# EasyEDA Pro project EasyEDA Pro full project export 0.07.epro, schematic schematic1, sheets 7 to 13 of 13

## Sheets
7 Processor: Page Name: Processor; Update Date: 2024-11-29; Drawn: EasyEDA; Page Size: A4
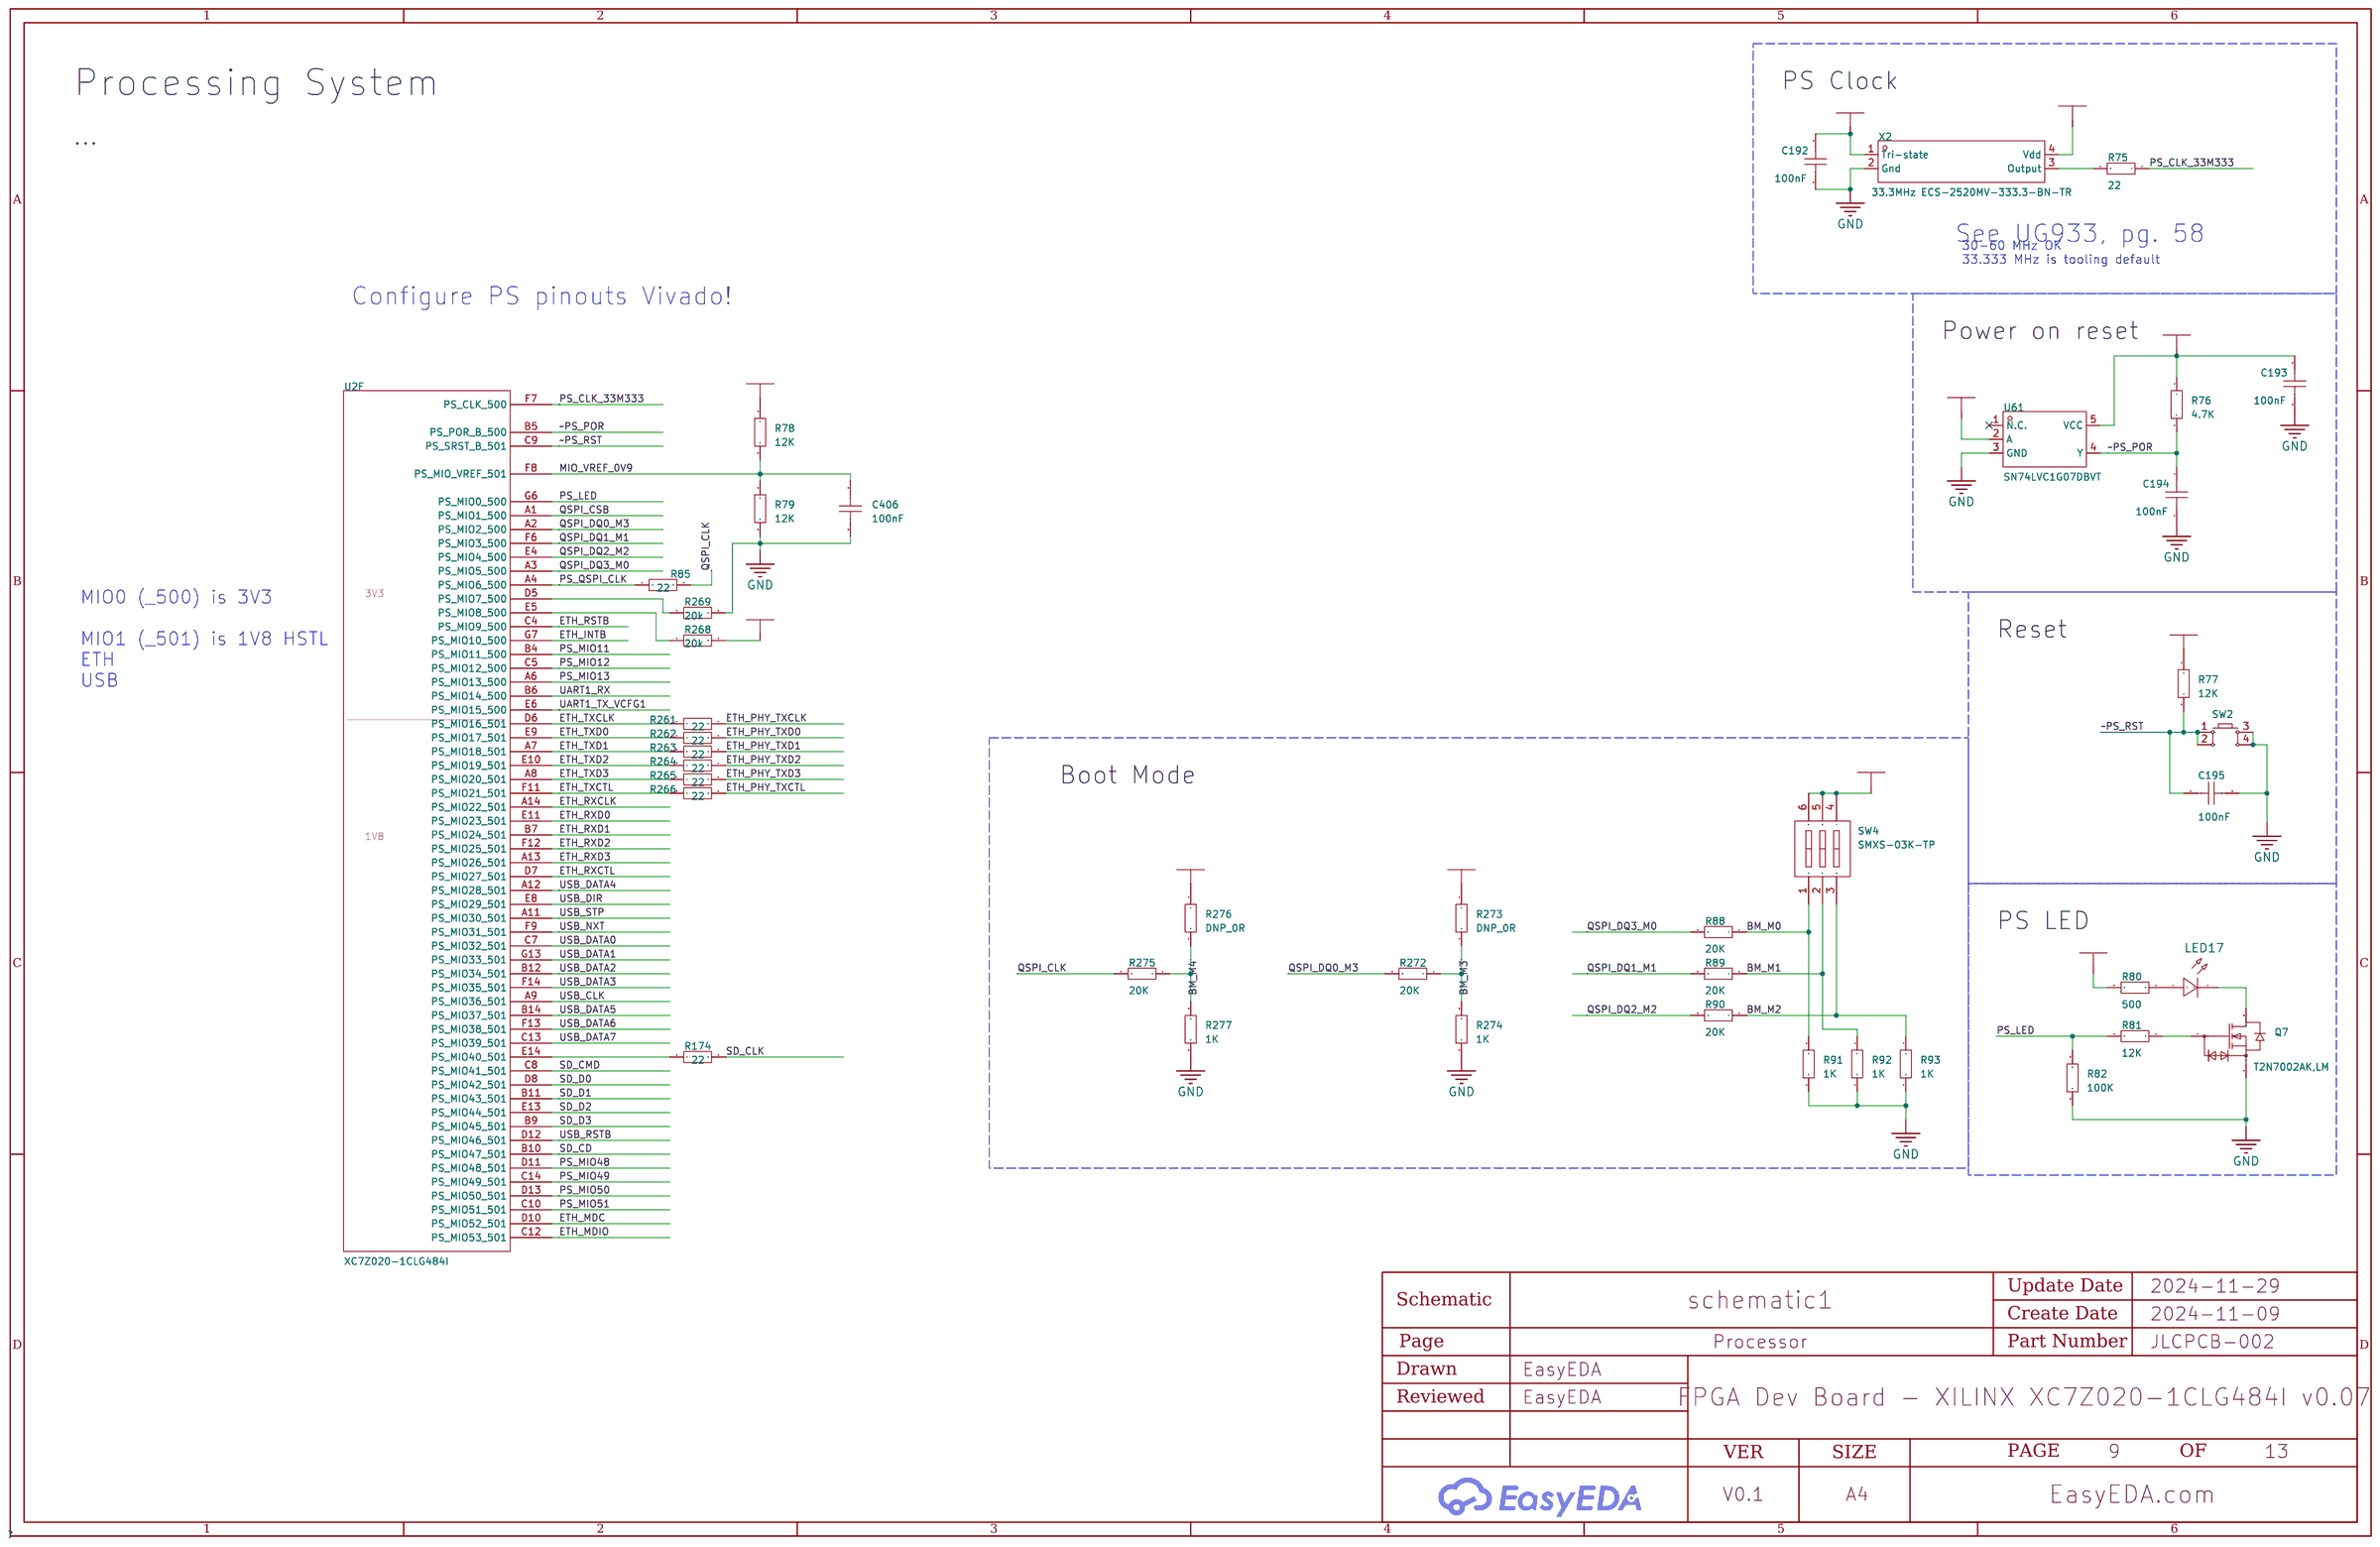
[diagram p6: Processor]
8 Program: Create Date: 2024-06-13; Page Name: Program; Project Name: FPGA Dev Board - XILINX XC7Z020-1CLG484I v0.06; Update Date: 2024-06-13; Drawn: EasyEDA; Page Size: A4
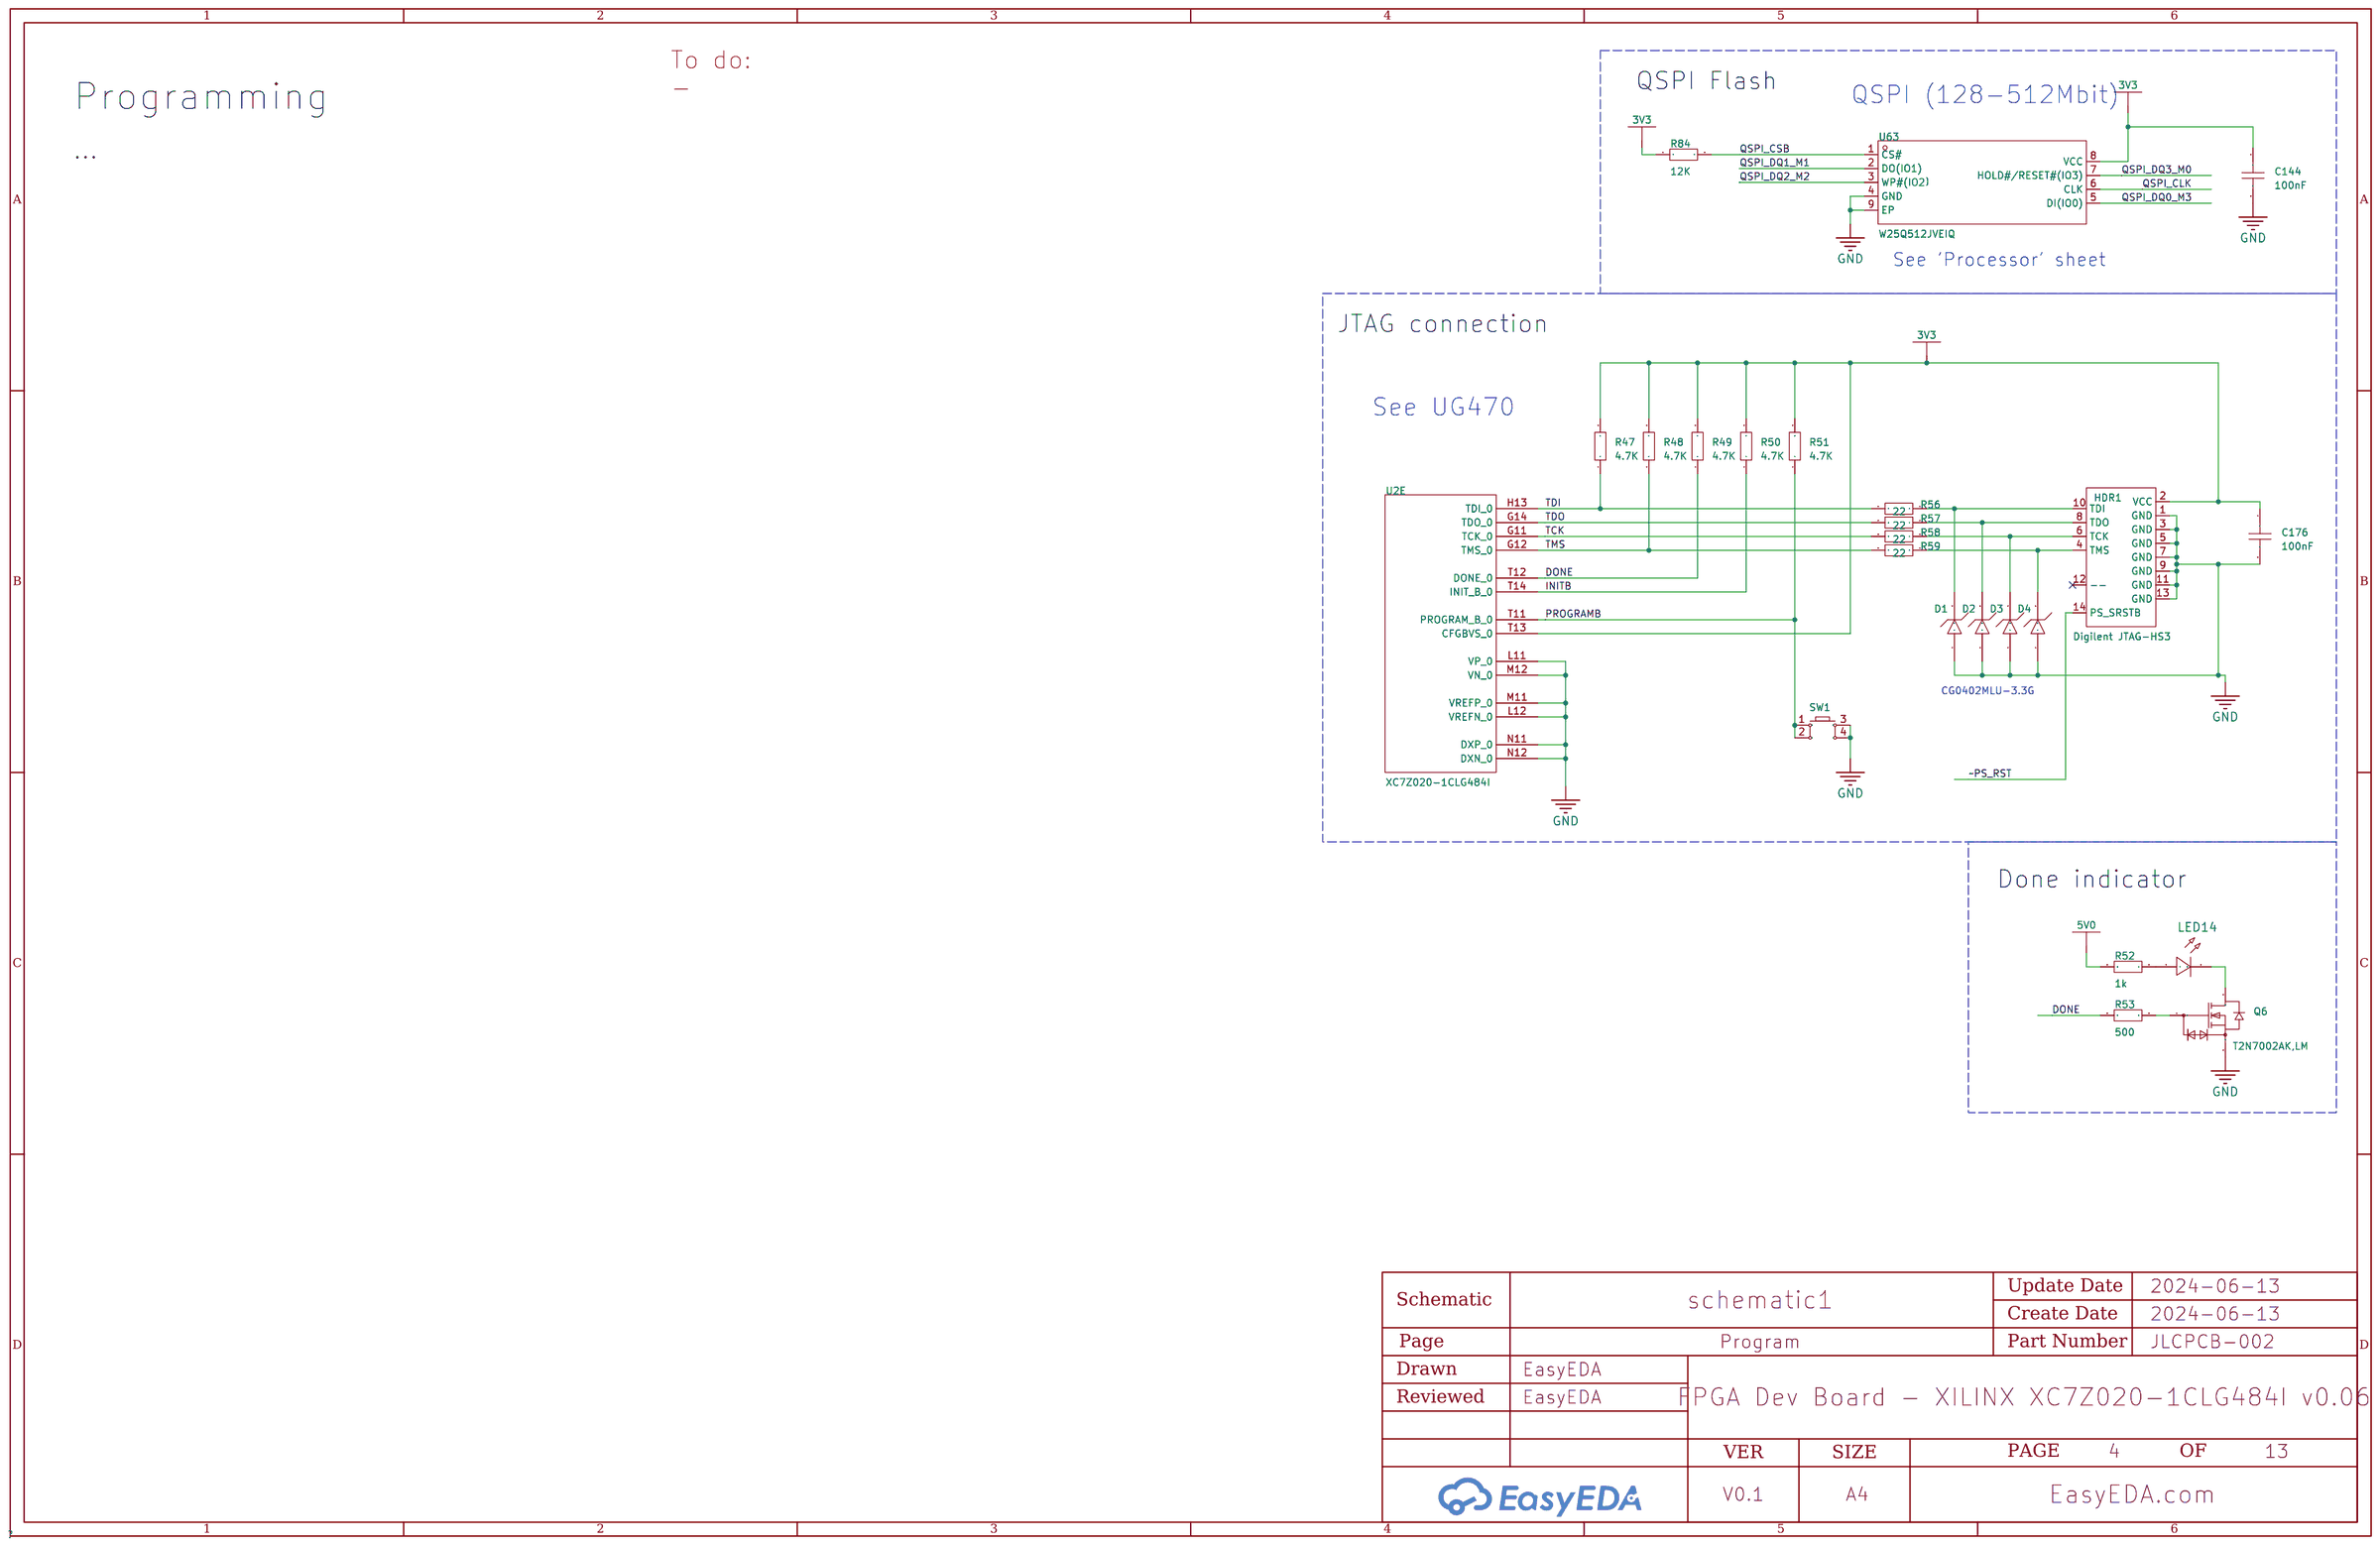
[diagram p7: Program]
9 HDMI: Create Date: 2024-04-13; Page Name: HDMI; Project Name: FPGA Dev Board - XILINX XC7Z020-1CLG484I; Schematic Name: Schematic1; Update Date: 2024-04-29; Drawn: EasyEDA; Page Size: A4
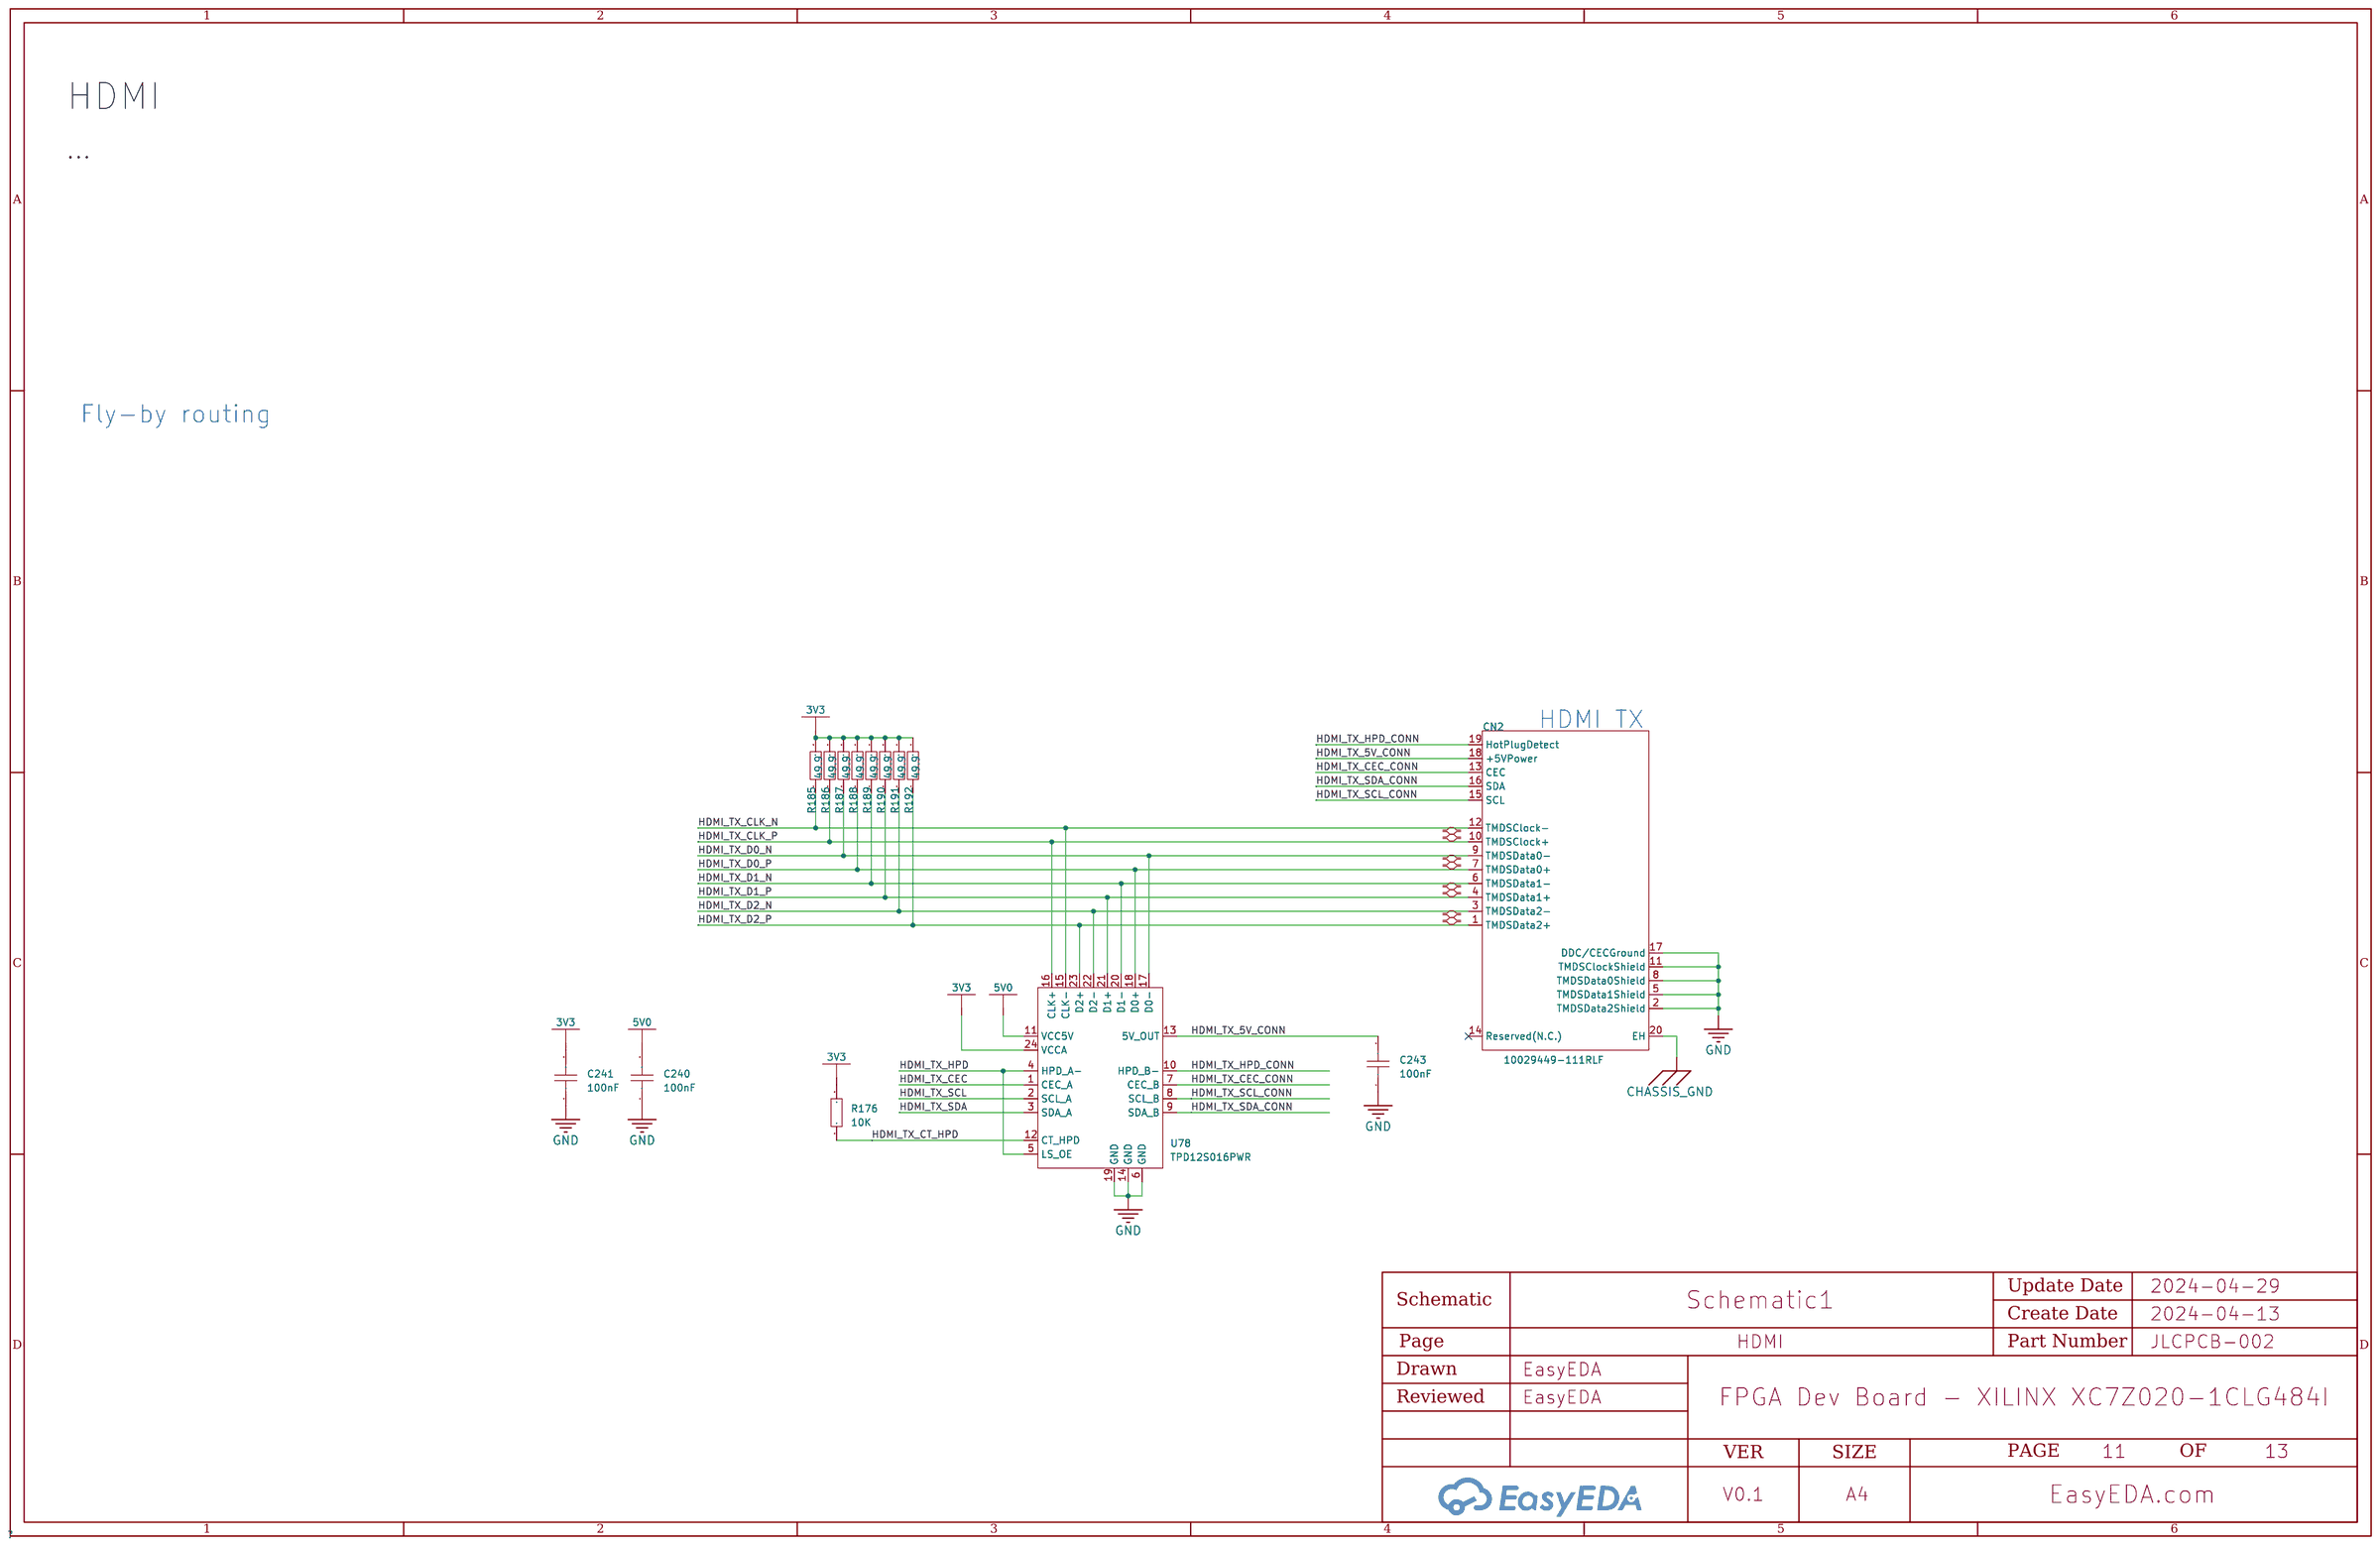
[diagram p8: HDMI]
10 Banks 34,35 - HDMI, Expansion: Page Name: Banks 34,35 - HDMI, Expansion; Update Date: 2024-11-09; Drawn: EasyEDA; Page Size: A4
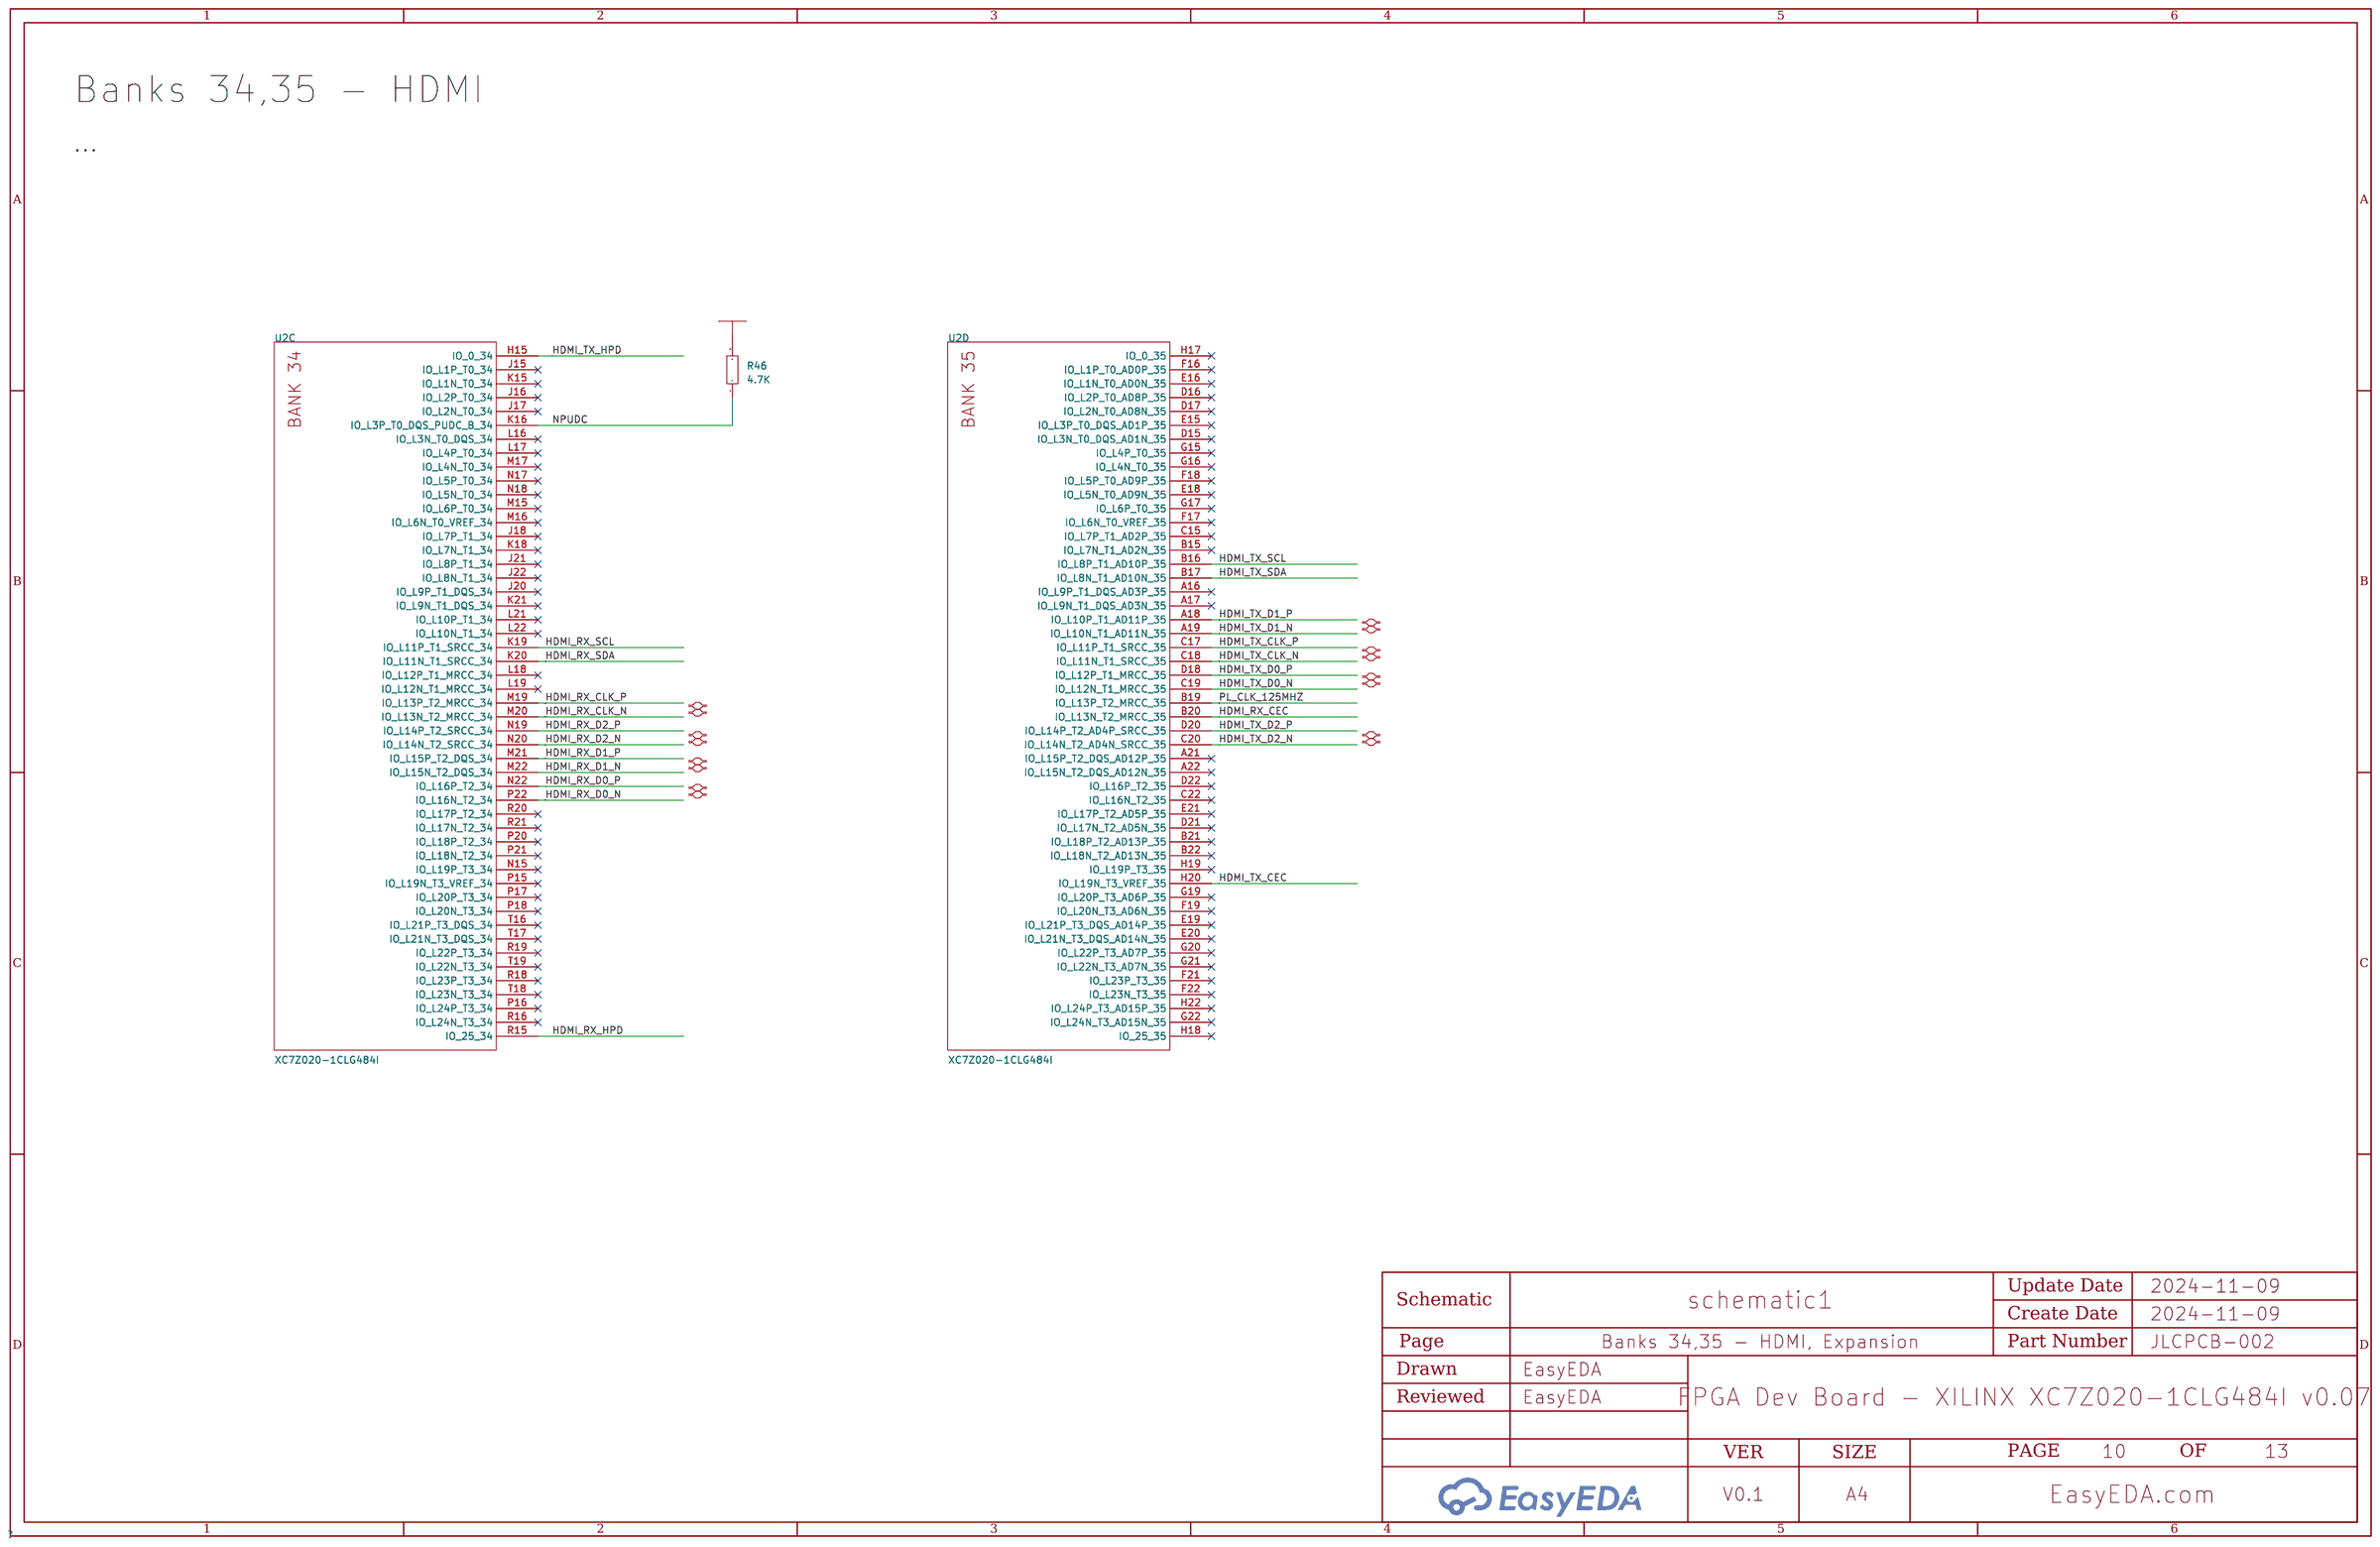
[diagram p9: Banks 34,35 - HDMI, Expansion]
11 Banks 13,33 - Expansion: Create Date: 2024-05-18; Page Name: Banks 13,33 - Expansion; Project Name: FPGA Dev Board - XILINX XC7Z020-1CLG484I v0.02; Update Date: 2024-05-18; Drawn: EasyEDA; Page Size: A4
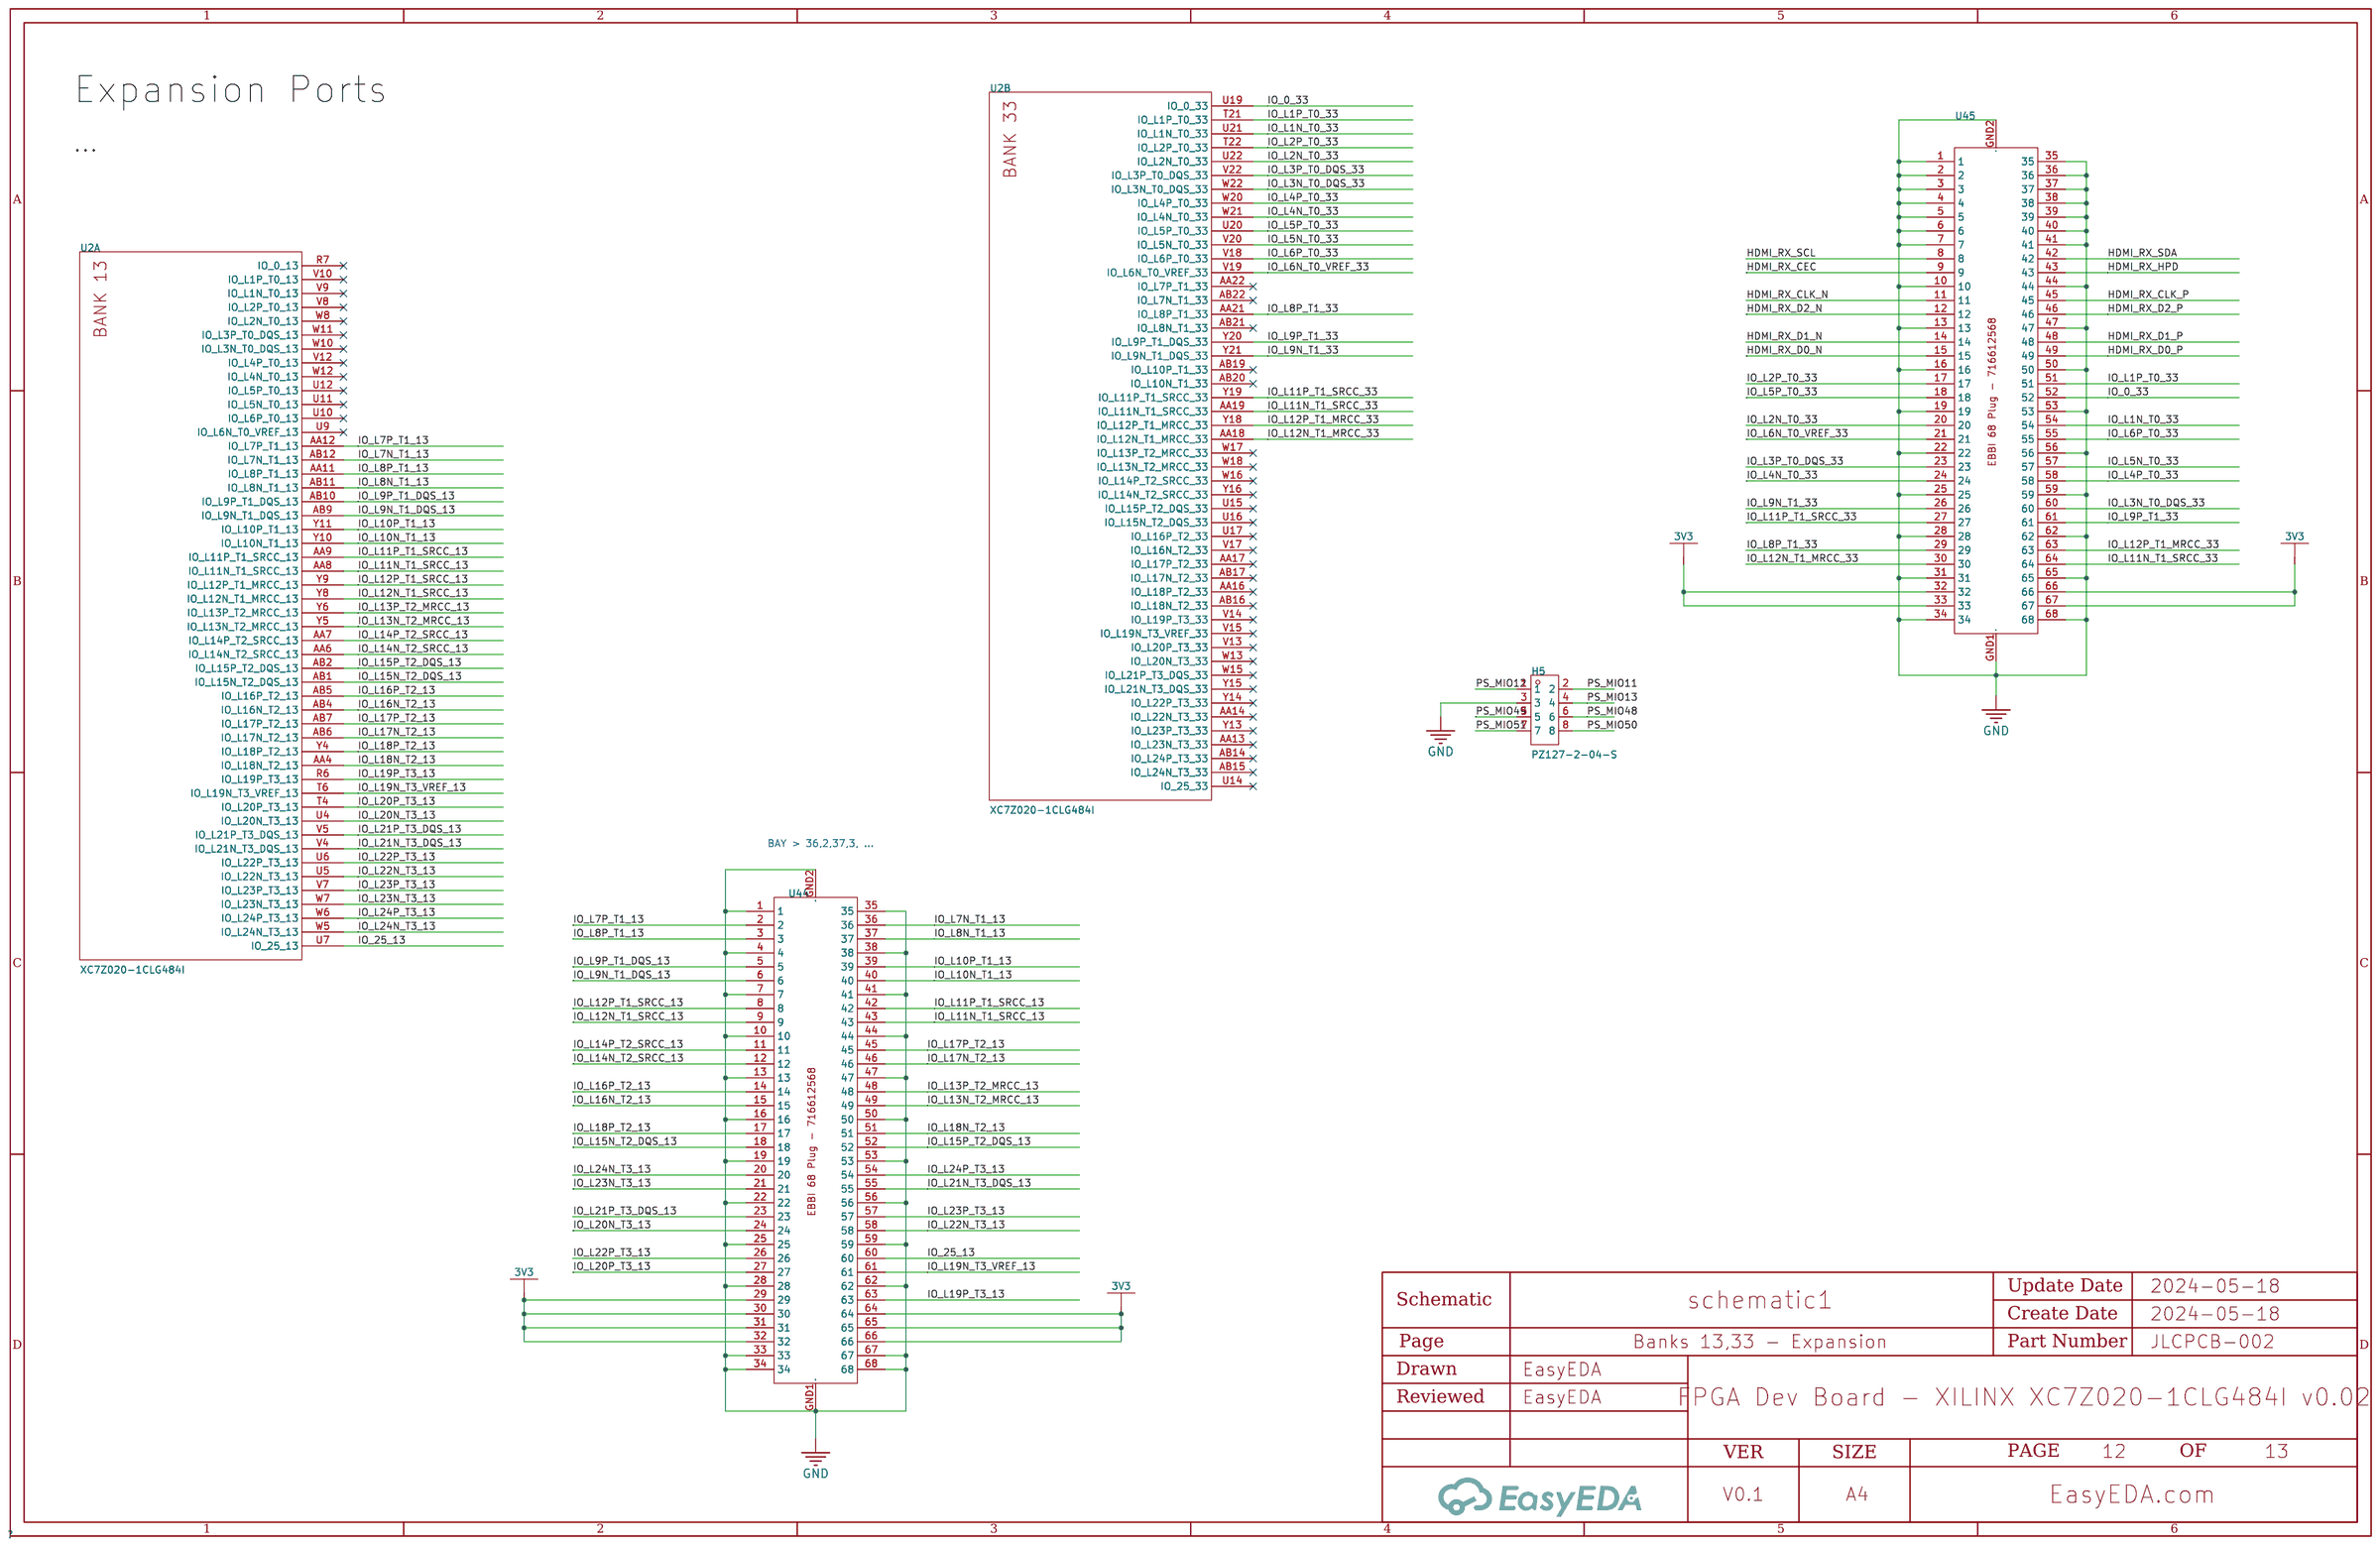
[diagram p10: Banks 13,33 - Expansion]
12 SD Card: Create Date: 2024-04-20; Page Name: SD Card; Project Name: FPGA Dev Board - XILINX XC7Z020-1CLG484I; Schematic Name: Schematic1; Update Date: 2024-04-29; Drawn: EasyEDA; Page Size: A4
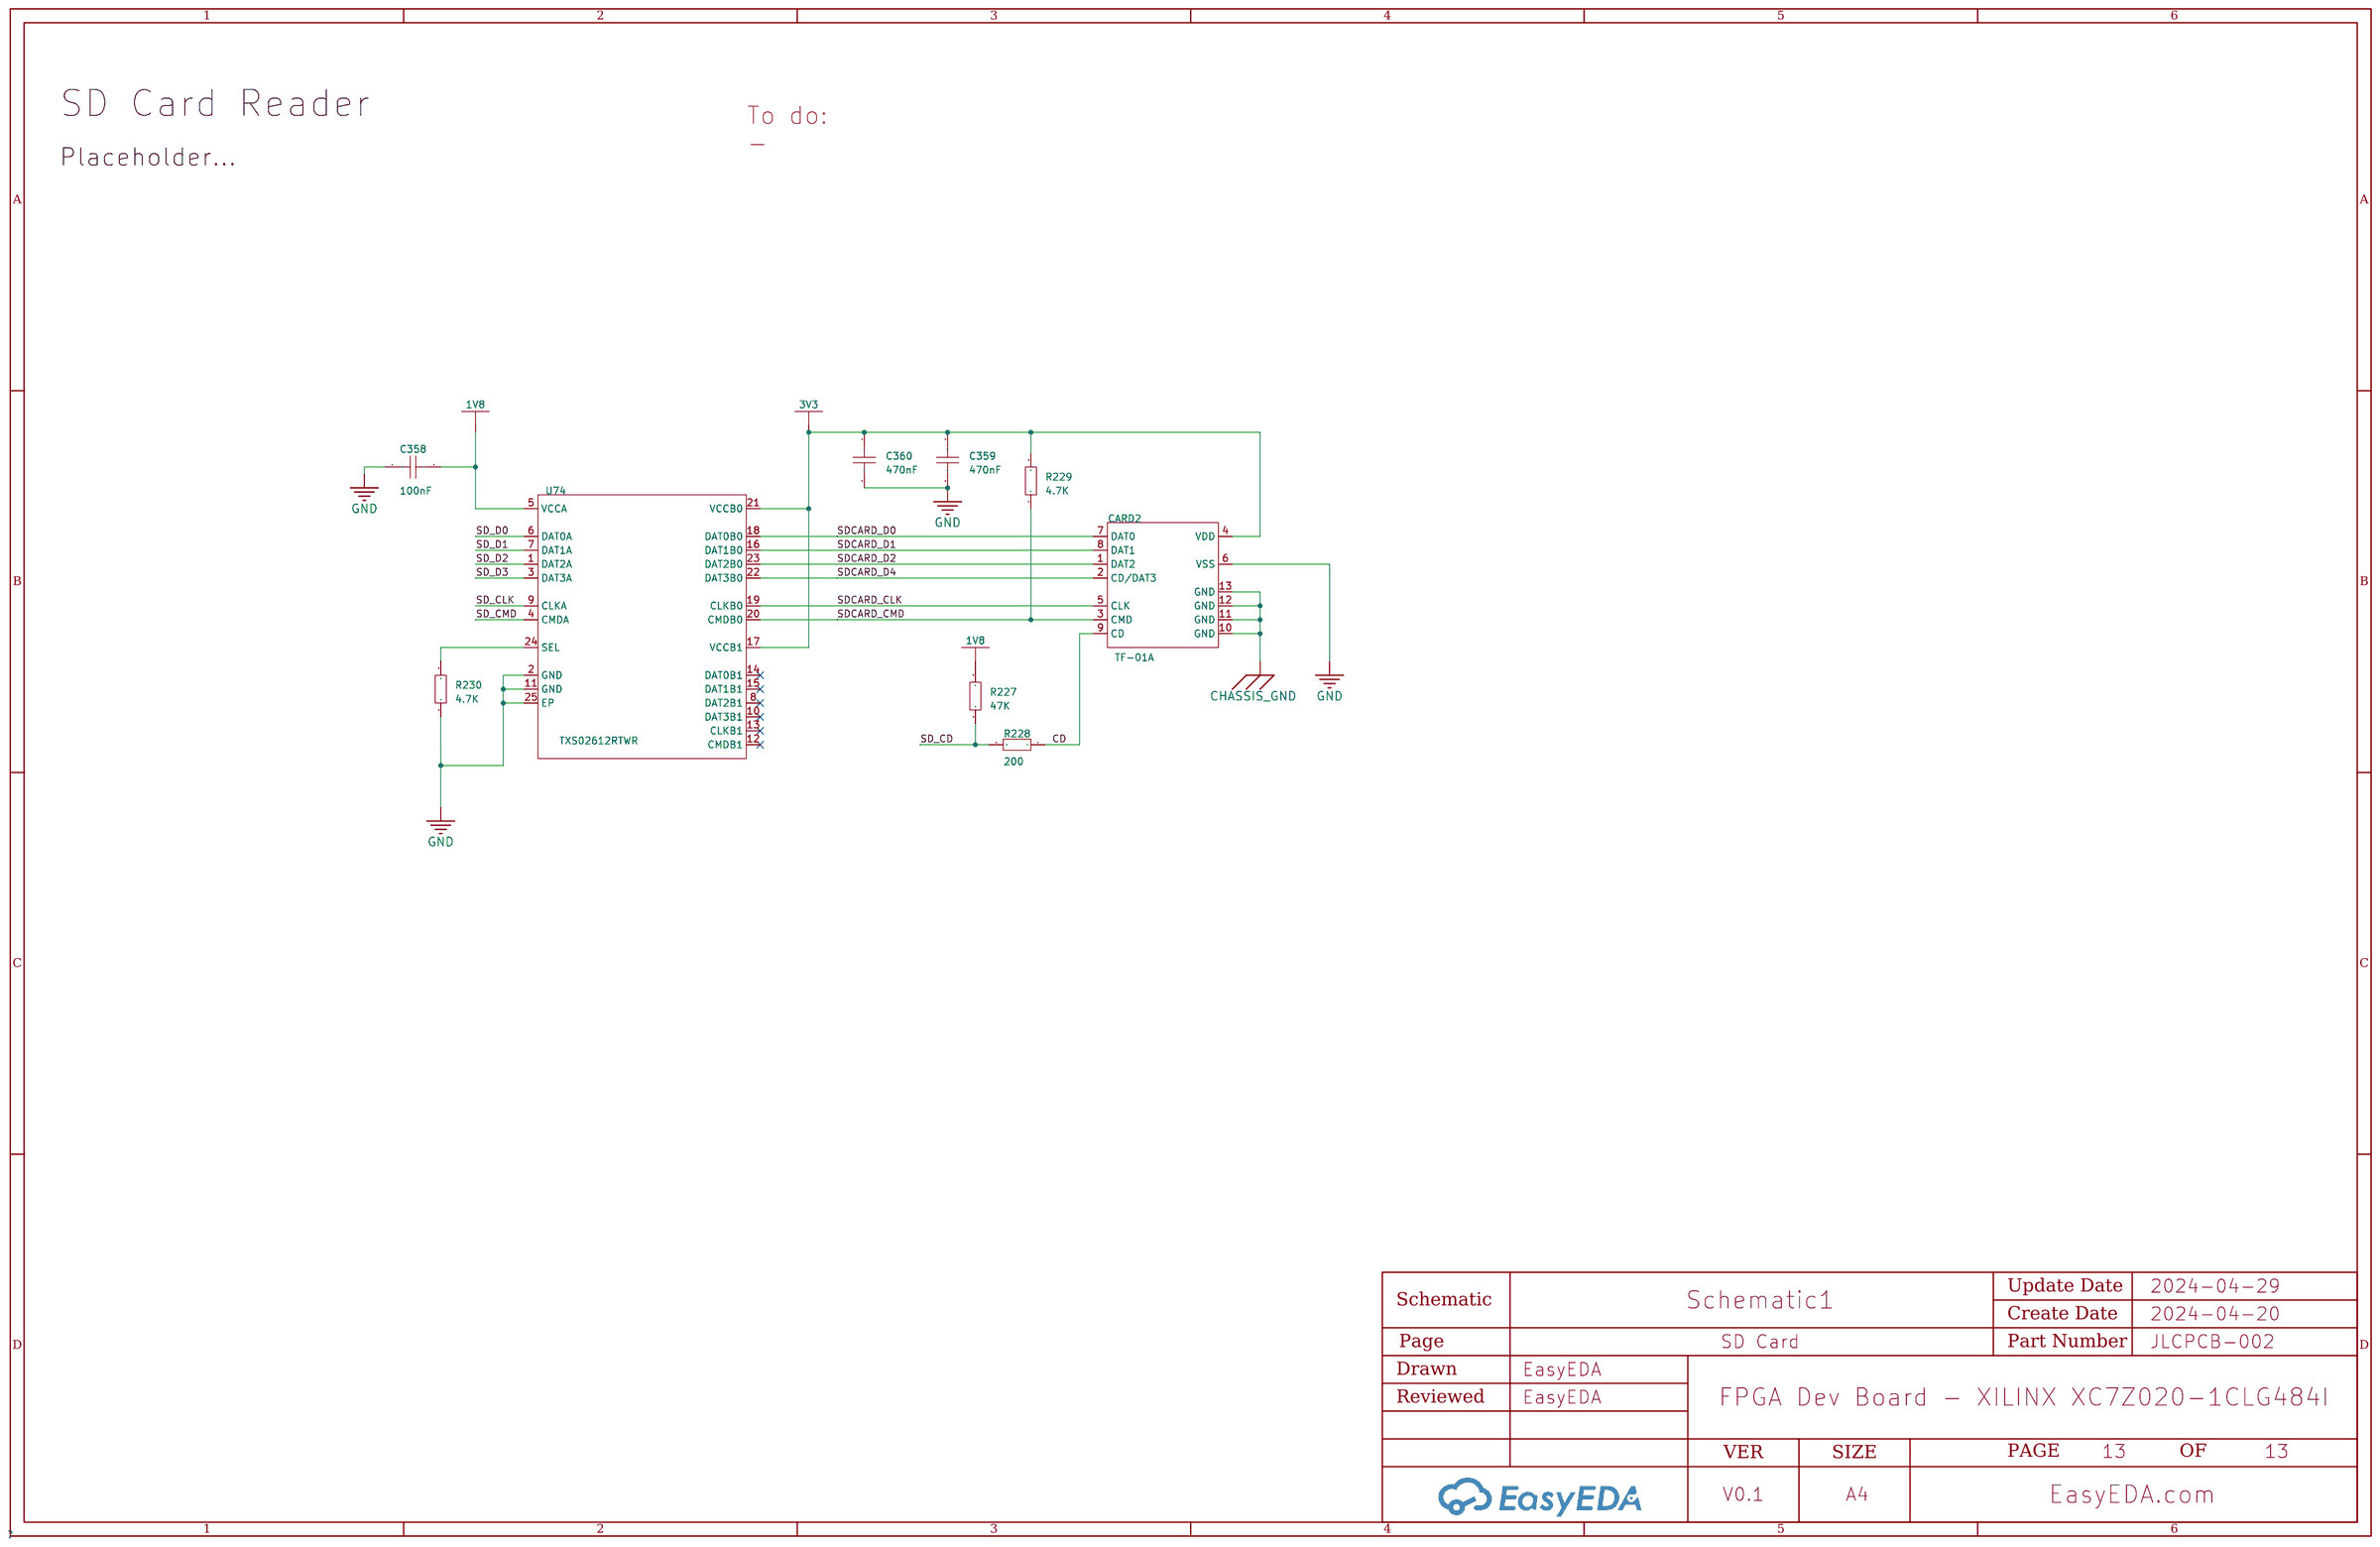
[diagram p11: SD Card]
13 USB USB3320: Create Date: 2024-04-21; Page Name: USB USB3320; Project Name: FPGA Dev Board - XILINX XC7Z020-1CLG484I; Schematic Name: Schematic1; Update Date: 2024-04-29; Drawn: EasyEDA; Page Size: A4
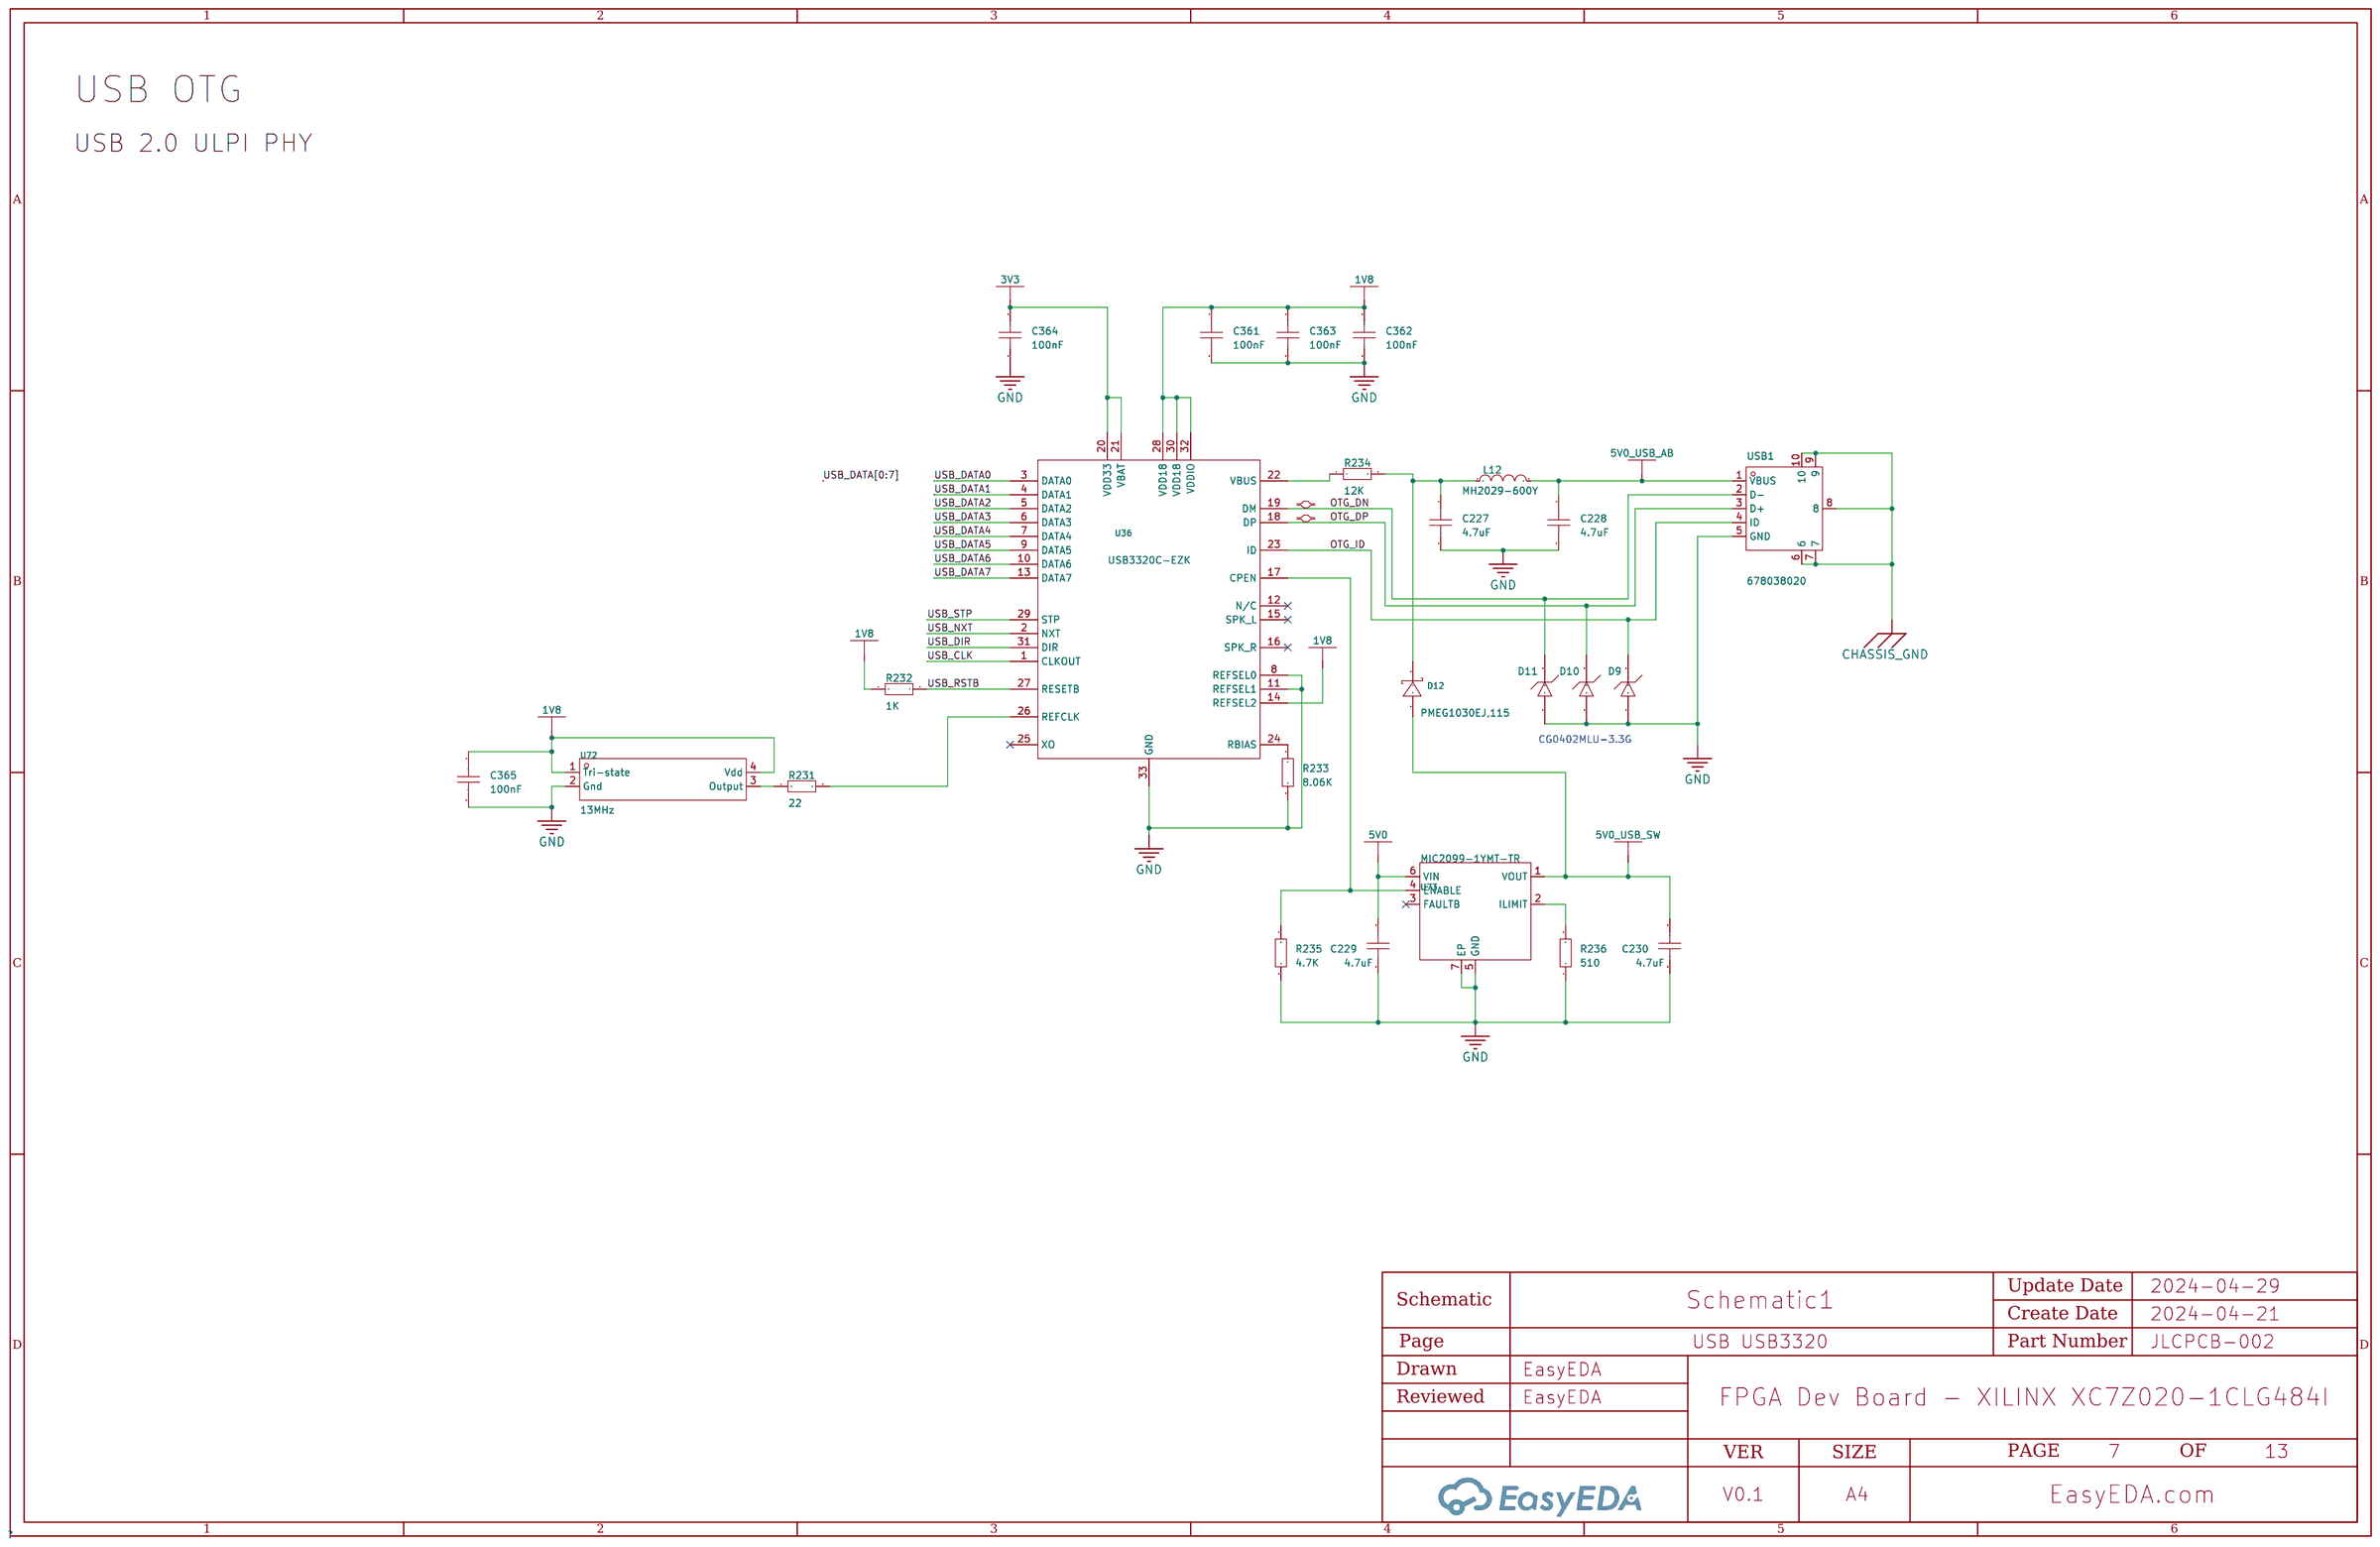
[diagram p12: USB USB3320]

## Parts
sheet Banks 13,33 - Expansion
H5  PZ127-2-04-S  [HDR-SMD_8P-P1.27-V-M-C2-C4-LS5.3]
U44  -  [EBBI 68 Plug - 716612568]
U45  -  [EBBI 68 Plug - 716612568]
sheet Banks 34,35 - HDMI, Expansion
R46  4.7K  [R0603]
sheet HDMI
C240  100nF  [C0603]
C241  100nF  [C0603]
C243  100nF  [C0603]
CN2  10029449-111RLF  [HDMI-SMD_10029449-001RLF]
R176  10K  [R0603]
R185  49.9  [R0402]
R186  49.9  [R0402]
R187  49.9  [R0402]
R188  49.9  [R0402]
R189  49.9  [R0402]
R190  49.9  [R0402]
R191  49.9  [R0402]
R192  49.9  [R0402]
U78  TPD12S016PWR  [TSSOP-24_L7.8-W4.4-P0.65-LS6.4-BL]
sheet Power
U2  XC7Z020-1CLG484I  [FBGA-484_L19.0-W19.0-R22-C22-P0.80-TL]  (sections 1,10,2,3,4,5,6,7,8,9)
sheet Processor
C192  100nF  [C0603]
C193  100nF  [C0603]
C194  100nF  [C0603]
C195  100nF  [C0603]
C406  100nF  [C0201]
LED17  -  [LED0603-R-RD]
Q7  T2N7002AK,LM  [SOT-23-3_L2.9-W1.3-P1.90-LS2.4-BR]
R75  22  [R0603]
R76  4.7K  [R0603]
R77  12K  [R0603]
R78  12K  [R0603]
R79  12K  [R0603]
R80  500  [R0603]
R81  12K  [R0603]
R82  100K  [R0603]
R85  22  [R0603]
R88  20K  [R0603]
R89  20K  [R0603]
R90  20K  [R0603]
R91  1K  [R0603]
R92  1K  [R0603]
R93  1K  [R0603]
R174  22  [R0603]
R261  22  [R0402]
R262  22  [R0402]
R263  22  [R0402]
R264  22  [R0402]
R265  22  [R0402]
R266  22  [R0402]
R268  20k  [R0402]
R269  20k  [R0402]
R272  20K  [R0603]
R273  DNP_0R  [R0603]
R274  1K  [R0603]
R275  20K  [R0603]
R276  DNP_0R  [R0603]
R277  1K  [R0603]
SW2  -  [SW-SMD_4P-L6.0-W6.0-P4.50-LS9.0-2]
SW4  SMXS-03K-TP  [SW-SMD_SMXS-03K-TP]
U61  SN74LVC1G07DBVT  [SOT-23-5_L2.9-W1.6-P0.95-LS2.8-BR]
X2  33.3MHz ECS-2520MV-333.3-BN-TR  [OSC-SMD_4P-L2.5-W2.0-BL]
sheet Program
C144  100nF  [C0603]
C176  100nF  [C0603]
D1  -  [D0402]
D2  -  [D0402]
D3  -  [D0402]
D4  -  [D0402]
HDR1  Digilent JTAG-HS3  [HDR-SMD_14P-P2.54-V-M-R2-C7-LS7.4]
LED14  -  [LED0603-R-RD]
Q6  T2N7002AK,LM  [SOT-23-3_L2.9-W1.3-P1.90-LS2.4-BR]
R47  4.7K  [R0603]
R48  4.7K  [R0603]
R49  4.7K  [R0603]
R50  4.7K  [R0603]
R51  4.7K  [R0603]
R52  1k  [R0603]
R53  500  [R0603]
R56  22  [R0603]
R57  22  [R0603]
R58  22  [R0603]
R59  22  [R0603]
R84  12K  [R0603]
SW1  -  [SW-SMD_4P-L6.0-W6.0-P4.50-LS9.0-2]
U63  W25Q512JVEIQ  [WSON-8_L8.0-W6.0-P1.27-TL-EP]
sheet SD Card
C358  100nF  [C0402]
C359  470nF  [C0402]
C360  470nF  [C0402]
CARD2  TF-01A  [TF-SMD_TF-02]
R227  47K  [R0402]
R228  200  [R0402]
R229  4.7K  [R0402]
R230  4.7K  [R0402]
U74  TXS02612RTWR  [WQFN-24_L4.0-W4.0-P0.50-TL-EP2.5]
sheet USB USB3320
C227  4.7uF  [C0603]
C228  4.7uF  [C0603]
C229  4.7uF  [C0603]
C230  4.7uF  [C0603]
C361  100nF  [C0402]
C362  100nF  [C0402]
C363  100nF  [C0402]
C364  100nF  [C0402]
C365  100nF  [C0402]
D9  -  [D0402]
D10  -  [D0402]
D11  -  [D0402]
D12  PMEG1030EJ,115  [SOD-323_L1.8-W1.3-LS2.5-RD]
L12  MH2029-600Y  [L0805]
R231  22  [R0402]
R232  1K  [R0402]
R233  8.06K  [R0402]
R234  12K  [R0402]
R235  4.7K  [R0402]
R236  510  [R0402]
U36  USB3320C-EZK  [QFN-32_L5.0-W5.0-P0.50-BL-EP3.4]
U72  13MHz  [OSC-SMD_4P-L2.5-W2.0-BL]
U73  MIC2099-1YMT-TR  [UDFN-6_L1.6-W1.6-P0.50-BL-EP1.2]
USB1  678038020  [MICRO-USB-SMD_MOLEX_678038020]

## Library data of the parts
H5 = PZ127-2-04-S: Pin Structure:2x4P Pitch:1.27mm Row Spacing:1.27mm Circluar Pins/Square Pins:Square Pins Mounting Type:Brick nogging Number of Rows:双排 Number of Pins:8P Current Rating (Max):1A Length of Mating Pin:4mm Insulation Height:1.5mm Length of End Connection Pin:; LCSC Part Name: 2x4P 间距:1.27mm 方针 立贴; Supplier Part: C3975187; Manufacturer: HCTL(华灿天禄); Supplier Footprint: SMD,P=1.27mm; JLCPCB Part Class: Extended Part; Datasheet: https://atta.szlcsc.com/upload/public/pdf/source/20230609/2ACB07ADC7D4DAF6D292F3D23C037F6C.pdf; Supplier: LCSC; Pin Structure: 2x4P; Pitch: 1.27mm; Row Spacing: 1.27mm; Circluar Pins/Square Pins: Square Pins; Mounting Type: Brick nogging; Number of Rows: 双排; Number of Pins: 8P; Current Rating (Max): 1A; Length of Mating Pin: 4mm; Insulation Height: 1.5mm; Operating Temperature Range: -40℃~+105℃; Soldering Temperature(Max): 260℃@10S; Color: Black
U44 U45 = EBBI 68 Plug - 716612568
R46-R53 R56-R59 R75-R82 R84 R85 R88-R93 R174 R176 R272-R277 = Res_0603: Supplier Footprint: 0603
C144 C176 C192-C195 C227-C230 C240 C241 C243 = CAP_0603: Supplier Footprint: 0603
CN2 = 10029449-111RLF: Supplier Part: C427307; Manufacturer: Amphenol; Supplier Footprint: SMD; JLCPCB Part Class: Extended Part; Datasheet: https://atta.szlcsc.com/upload/public/pdf/source/20190916/C428493_2220CBF119BDA60368E33A9DE2491E6D.pdf; Supplier: LCSC
R185-R192 R227-R236 R261-R266 R268 R269 = Res_0402: Supplier Footprint: 0402
U78 = TPD12S016PWR: Supply Voltage:4.5V~5.5V Supply Voltage:4.5V~5.5V; LCSC Part Name: 具有I2C电平转换缓冲器 12通道ESD保护和限流负载开关的HDMI配套芯片; Supplier Part: C201665; Manufacturer: TI(德州仪器); Supplier Footprint: TSSOP-24; JLCPCB Part Class: Extended Part; Datasheet: https://www.ti.com/cn/lit/gpn/tpd12s016; Supplier: LCSC; Supply Voltage: 4.5V~5.5V
U2 = XC7Z020-1CLG484I: LCSC Part Name: XC7Z020-1CLG484I -; Supplier Part: C89055; Manufacturer: XILINX(赛灵思); Supplier Footprint: BGA-484; JLCPCB Part Class: Extended Part; Datasheet: https://atta.szlcsc.com/upload/public/pdf/source/20180115/C157624_15160149665121269420.pdf; Supplier: LCSC
C406 = CAP_0201: Supplier Footprint: 0201
LED14 LED17 = LED_0603-R: Supplier Footprint: 0603
Q6 Q7 = T2N7002AK,LM: Type:1个NChannel Drain Source Voltage (Vdss):60V Continuous Drain Current (Id): Power Dissipation (Pd): Drain Source On Resistance (RDS(on)@Vgs,Id): Gate Threshold Voltage (Vgs(th)@Id):2.1V@250uA Total Gate Charge (Qg@Vgs):350pC@4.5V Input Capacitance (Cis; LCSC Part Name: 1个N沟道 耐压:60V 电流:200mA; Supplier Part: C516175; Manufacturer: TOSHIBA(东芝); Supplier Footprint: SOT-23; JLCPCB Part Class: Extended Part; Datasheet: https://atta.szlcsc.com/upload/public/pdf/source/20200417/C516175_139D8835A6055C9B9867ECE2E4073B8F.pdf; Supplier: LCSC; Type: 1个NChannel; Drain Source Voltage (Vdss): 60V; Gate Threshold Voltage (Vgs(th)@Id): 2.1V@250uA; Total Gate Charge (Qg@Vgs): 350pC@4.5V; Input Capacitance (Ciss@Vds): 17pF@10V
SW1 SW2 = Key_SMD_6x6x6.5: Supplier Footprint: SMD
SW4 = SMXS-03K-TP: Type:- Circuit:- Number of Positions:3Bit Pin Style:- Lead Pitch:2.54mm Current Rating:25mA Voltage Rating:24V Operating Temperature:-30℃~+85℃ Operating Temperature:-30℃~+85℃ Operating Life:3千次 Color:Black; LCSC Part Name: 间距2.54mm 3位拨码开关; Supplier Part: C5439762; Manufacturer: SM Switch; Supplier Footprint: SMD; JLCPCB Part Class: Extended Part; Datasheet: https://atta.szlcsc.com/upload/public/pdf/source/20230330/8AD8133DE12F908DA8232583C3CE8C7F.pdf; Supplier: LCSC; Number of Positions: 3Bit; Lead Pitch: 2.54mm; Current Rating: 25mA; Voltage Rating: 24V; Operating Temperature: -30℃~+85℃; Operating Life: 3千次; Color: Black
U61 = SN74LVC1G07DBVT: output type:Open Drain Supply Voltage:1.65V~5.5V Supply Voltage:1.65V~5.5V Number of Elements:1 Number of Bits per Element:1 Sink Current:32mA Logic Family:74LVC Operating Temperature:-40℃~+125℃ Operating Temperature:-40℃~+125℃; Supplier Part: C2867373; Manufacturer: TI(德州仪器); Supplier Footprint: SOT-23-5; JLCPCB Part Class: Extended Part; Datasheet: https://www.ti.com/cn/lit/gpn/sn74lvc1g07; Supplier: LCSC; output type: Open Drain; Supply Voltage: 1.65V~5.5V; Number of Elements: 1; Number of Bits per Element: 1; Sink Current: 32mA; Logic Family: 74LVC; Operating Temperature: -40℃~+125℃
X2 = ECS-2520MV-120-BN-TR: Frequency:12MHz Output Type:HCMOS Supply Voltage:1.6V~3.6V Supply Voltage:1.6V~3.6V Supply Current (Max):6mA Frequency Stability(Full temperature range):±50ppm Frequency Stability(Full temperature range):±50ppm Operating Temperature:-40℃~+85℃ Operating Te; Supplier Part: C405460; Manufacturer: ECS; Supplier Footprint: SMD2520-4P; JLCPCB Part Class: Extended Part; Datasheet: https://atta.szlcsc.com/upload/public/pdf/source/20190722/C405472_2FCB2E02432CF0A2EC5ED9723E17E19C.pdf; Supplier: LCSC; Output Type: HCMOS; Supply Voltage: 1.6V~3.6V; Supply Current (Max): 6mA; Frequency Stability(Full temperature range): ±50ppm; Operating Temperature: -40℃~+85℃
D1-D4 D9-D11 = Zener Diode
HDR1 = PZ254-2-07-S: Pin Structure:2x7P Pitch:2.54mm Row Spacing:2.54mm Circluar Pins/Square Pins:Square Pins Mounting Type:Brick nogging Number of Rows:双排 Number of Pins:14P Current Rating (Max):3A Voltage Rating (Max):250V Length of Mating Pin:6mm Insulation Height:2.5mm Le; LCSC Part Name: 2x7P 间距:2.54mm 方针 立贴 黑色; Supplier Part: C3294465; Manufacturer: HCTL(华灿天禄); Supplier Footprint: SMD,P=2.54mm; JLCPCB Part Class: Extended Part; Datasheet: https://atta.szlcsc.com/upload/public/pdf/source/20230609/FB2B5B924AA338E6CB93C3BD1D012B72.pdf; Supplier: LCSC; Pin Structure: 2x7P; Pitch: 2.54mm; Row Spacing: 2.54mm; Circluar Pins/Square Pins: Square Pins; Mounting Type: Brick nogging; Number of Rows: 双排; Number of Pins: 14P; Current Rating (Max): 3A; Voltage Rating (Max): 250V; Length of Mating Pin: 6mm; Insulation Height: 2.5mm; Operating Temperature Range: -40℃~+105℃; Soldering Temperature(Max): 260℃@5S; Color: Black
U63 = W25Q512JVEIQ: Supplier Part: C3034691; Manufacturer: WINBOND(华邦); Supplier Footprint: WSON-8-EP(6x8); JLCPCB Part Class: Extended Part; Datasheet: https://atta.szlcsc.com/upload/public/pdf/source/20210702/7B9F541DD90F5EF592FF960179BA566A.pdf; Supplier: LCSC
C358-C365 = CAP_0402: Supplier Part: C1525; Supplier Footprint: 0402
CARD2 = TF-01A_C2889258: Card Connection Mode:Self bomb Card Type:MicroSD卡(TF卡) Connector Type:Deck Maximum Body Height:2mm Operating Temperature Range:- Operating Temperature Range:-; LCSC Part Name: 自弹式 MicroSD卡(TF卡) 卡座; Supplier Part: C2889258; Manufacturer: Yuandi(元迪); Supplier Footprint: SMD; JLCPCB Part Class: Extended Part; Datasheet: https://atta.szlcsc.com/upload/public/pdf/source/20210830/44259D2B93BF4B637A446EF1520C4989.pdf; Supplier: LCSC; Card Connection Mode: Self bomb; Card Type: MicroSD卡(TF卡); Connector Type: Deck; Maximum Body Height: 2mm
U74 = TXS02612RTWR: Supplier Part: C140276; Manufacturer: TI(德州仪器); Supplier Footprint: WQFN-24-EP(4x4); JLCPCB Part Class: Extended Part; Datasheet: https://www.ti.com/cn/lit/gpn/txs02612; Supplier: LCSC
D12 = PMEG1030EJ,115: Forward Voltage (Vf@If):530mV@3A Reverse Voltage (Vr):10V Average Rectified Current (Io):3A Reverse Leakage Current (Ir):3mA@10V; LCSC Part Name: 电压:10V 电流:3A; Supplier Part: C133633; Manufacturer: Nexperia(安世); Supplier Footprint: SOD-323F; JLCPCB Part Class: Extended Part; Datasheet: https://atta.szlcsc.com/upload/public/pdf/source/20170930/C133633_1506736465007997462.pdf; Supplier: LCSC; Forward Voltage (Vf@If): 530mV@3A; Reverse Voltage (Vr): 10V; Average Rectified Current (Io): 3A; Reverse Leakage Current (Ir): 3mA@10V
L12 = MH2029-600Y: Impedance @ Frequency:60Ω@100MHz Tolerance:±25% Tolerance:±25% DC Resistance:20mΩ Current Rating:5A Circuits:1; LCSC Part Name: 单路 0805磁珠 阻抗60Ω@100MHz; Supplier Part: C780182; Manufacturer: BOURNS; Supplier Footprint: 0805; JLCPCB Part Class: Extended Part; Datasheet: https://atta.szlcsc.com/upload/public/pdf/source/20200907/C780182_6AA2A849D07FE675FBDEC0D82719ED6E.pdf; Supplier: LCSC; Impedance @ Frequency: 60Ω@100MHz; Tolerance: ±25%; DC Resistance: 20mΩ; Current Rating: 5A; Circuits: 1
U36 = USB3320C-EZK: Applications Function:Transceiver Protocol: Supply Voltage:1.8V~3.3V Supply Voltage:1.8V~3.3V Operating Temperature:-40℃~+85℃ Operating Temperature:-40℃~+85℃; Supplier: LCSC; Manufacturer: MICROCHIP(美国微芯); Supplier Part: C52447; JLCPCB Part Class: Extended Part; LCSC Part Name: 高度集成全功能高速usb2.0 ULPI收发器; Supplier Footprint: QFN-32-EP(5x5); Datasheet: https://atta.szlcsc.com/upload/public/pdf/source/20210326/C52447_82C15BC01EB7B75485FAEA128A6533A1.pdf; Applications Function: Transceiver; Supply Voltage: 1.8V~3.3V; Operating Temperature: -40℃~+85℃
U72 = ECS-2520MV-130-BN-TR: Frequency:13MHz Output Type:HCMOS Supply Voltage:1.8V~3.3V Supply Voltage:1.8V~3.3V Supply Current (Max):6mA Operating Temperature:-40℃~+85℃ Operating Temperature:-40℃~+85℃; Supplier Part: C2613032; Manufacturer: ECS; Supplier Footprint: SMD2520-4P; JLCPCB Part Class: Extended Part; Datasheet: https://atta.szlcsc.com/upload/public/pdf/source/20210704/568637C0C7037C467E653884F0554681.pdf; Supplier: LCSC; Output Type: HCMOS; Supply Voltage: 1.8V~3.3V; Supply Current (Max): 6mA; Operating Temperature: -40℃~+85℃
U73 = MIC2099-1YMT-TR: Supplier: LCSC; Supplier Part: C621526; Manufacturer: MICROCHIP(美国微芯); JLCPCB Part Class: Extended Part; Supplier Footprint: UDFN-6; Datasheet: https://atta.szlcsc.com/upload/public/pdf/source/20221017/AC127D1247B87A2B89B1D0C57C8A8D74.pdf
USB1 = 678038020: Connector Type:Mini-AB Standard:USB 2.0 Gender:Female Number of Ports:1 Number of Contacts:5P Mounting Style:卧贴 Current Rating - Power (Max):- Operating Temperature Range:- Operating Temperature Range:-; LCSC Part Name: Mini-AB 母 卧贴; Supplier Part: C564922; Manufacturer: MOLEX; Supplier Footprint: SMD; JLCPCB Part Class: Extended Part; Datasheet: https://atta.szlcsc.com/upload/public/pdf/source/20220505/180EF66E296177D74348FB1528A67F92.pdf; Supplier: LCSC; Connector Type: Mini-AB; Standard: USB 2.0; Gender: Female; Number of Ports: 1; Number of Contacts: 5P; Mounting Style: 卧贴

## Nets
1V8: C358.2 C361.1 C362.1 C363.1 C365.1 R77.1 R78.1 R227.2 R232.1 U36.14(REFSEL2) U36.28(VDD18) U36.30(VDD18) U36.32(VDDIO) U72.1(Tri-state) U72.4(Vdd) U74.5(VCCA) ; also on sheet 2 3 6
3V3: C144.1 C176.1 C192.1 C193.1 C241.2 C359.1 C360.1 C364.1 CARD2.4(VDD) HDR1.2(VCC) R46.2 R47.2 R48.2 R49.2 R50.2 R51.2 R76.1 R84.1 R176.2 R185.2 R186.2 R187.2 R188.2 R189.2 R190.2 R191.2 R192.2 R229.2 R268.2 R273.1 R276.1 SW4.4 SW4.5 SW4.6 U2.T13(CFGBVS_0) U36.20(VDD33) U36.21(VBAT) U44.29 U44.30 U44.31 U44.32 U44.64 U44.65 U44.66 U45.32 U45.33 U45.66 U45.67 U61.5(VCC) U63.8(VCC) U74.17(VCCB1) U74.21(VCCB0) U78.24(VCCA) X2.1(Tri-state) X2.4(Vdd) ; also on sheet 2 3 5 6
5V0: C229.1 C240.2 R52.2 R80.2 U73.6(VIN) U78.11(VCC5V) ; also on sheet 1 2 3 5
5V0_USB_AB: C228.1 L12.2 USB1.1(VBUS)
5V0_USB_SW: C230.1 D12.2(A) U73.1(VOUT)
GND: C144.2 C176.2 C192.2 C193.2 C194.2 C195.2 C227.2 C228.2 C229.2 C230.2 C240.1 C241.1 C243.1 C358.1 C359.2 C360.2 C361.2 C362.2 C363.2 C364.2 C365.2 C406.2 CARD2.6(VSS) CN2.2(TMDSData2Shield) CN2.5(TMDSData1Shield) CN2.8(TMDSData0Shield) CN2.11(TMDSClockShield) CN2.17(DDC/CECGround) D1.1 D2.1 D3.1 D4.1 D9.1 D10.1 D11.1 H5.3 HDR1.1(GND) HDR1.3(GND) HDR1.5(GND) HDR1.7(GND) HDR1.9(GND) HDR1.11(GND) HDR1.13(GND) Q6.2(S) Q7.2(S) R79.2 R82.2 R91.2 R92.2 R93.2 R230.1 R233.1 R235.1 R236.1 R269.2 R274.2 R277.2 SW1.3 SW1.4 SW2.3 SW2.4 U2.L11(VP_0) U2.L12(VREFN_0) U2.M11(VREFP_0) U2.M12(VN_0) U2.N11(DXP_0) U2.N12(DXN_0) U36.8(REFSEL0) U36.11(REFSEL1) U36.33(GND) U44.1 U44.4 U44.7 U44.10 U44.13 U44.16 U44.19 U44.22 U44.25 U44.28 U44.33 U44.34 U44.35 U44.38 U44.41 U44.44 U44.47 U44.50 U44.53 U44.56 U44.59 U44.62 U44.67 U44.68 U44.GND1(GND) U44.GND2(69) U45.1 U45.2 U45.3 U45.4 U45.5 U45.6 U45.7 U45.10 U45.13 U45.16 U45.19 U45.22 U45.25 U45.28 U45.31 U45.34 U45.35 U45.36 U45.37 U45.38 U45.39 U45.40 U45.41 U45.44 U45.47 U45.50 U45.53 U45.56 U45.59 U45.62 U45.65 U45.68 U45.GND1(GND) U45.GND2(69) U61.3(GND) U63.4(GND) U63.9(EP) U72.2(Gnd) U73.5(GND) U73.7(EP) U74.2(GND) U74.11(GND) U74.25(EP) U78.6(GND) U78.14(GND) U78.19(GND) USB1.5(GND) X2.2(Gnd) ; also on sheet 1 2 3 4 5 6
BM_M0: R88.1 R91.1 SW4.1
BM_M1: R89.1 R92.1 SW4.2
BM_M2: R90.1 R93.1 SW4.3
BM_M3: R272.1 R273.2 R274.1
BM_M4: R275.1 R276.2 R277.1
CD: CARD2.9(CD) R228.1
CHASSIS_GND: CARD2.10(GND) CARD2.11(GND) CARD2.12(GND) CARD2.13(GND) CN2.20(EH) USB1.6 USB1.7 USB1.8 USB1.9 USB1.10 ; also on sheet 3 5 6
DONE: R49.1 R53.2 U2.T12(DONE_0)
ETH_INTB: U2.G7(PS_MIO10_500) ; also on sheet 6
ETH_MDC: U2.D10(PS_MIO52_501) ; also on sheet 6
ETH_MDIO: U2.C12(PS_MIO53_501) ; also on sheet 6
ETH_PHY_TXCLK: R261.2 ; also on sheet 6
ETH_PHY_TXCTL: R266.2 ; also on sheet 6
ETH_PHY_TXD0: R262.2 ; also on sheet 6
ETH_PHY_TXD1: R263.2 ; also on sheet 6
ETH_PHY_TXD2: R264.2 ; also on sheet 6
ETH_PHY_TXD3: R265.2 ; also on sheet 6
ETH_RSTB: U2.C4(PS_MIO9_500) ; also on sheet 6
ETH_RXCLK: U2.A14(PS_MIO22_501) ; also on sheet 6
ETH_RXCTL: U2.D7(PS_MIO27_501) ; also on sheet 6
ETH_RXD0: U2.E11(PS_MIO23_501) ; also on sheet 6
ETH_RXD1: U2.B7(PS_MIO24_501) ; also on sheet 6
ETH_RXD2: U2.F12(PS_MIO25_501) ; also on sheet 6
ETH_RXD3: U2.A13(PS_MIO26_501) ; also on sheet 6
ETH_TXCLK: R261.1 U2.D6(PS_MIO16_501)
ETH_TXCTL: R266.1 U2.F11(PS_MIO21_501)
ETH_TXD0: R262.1 U2.E9(PS_MIO17_501)
ETH_TXD1: R263.1 U2.A7(PS_MIO18_501)
ETH_TXD2: R264.1 U2.E10(PS_MIO19_501)
ETH_TXD3: R265.1 U2.A8(PS_MIO20_501)
HDMI_RX_CEC: U2.B20(IO_L13N_T2_MRCC_35) U45.9
HDMI_RX_CLK_N: U2.M20(IO_L13N_T2_MRCC_34) U45.11
HDMI_RX_CLK_P: U2.M19(IO_L13P_T2_MRCC_34) U45.45
HDMI_RX_D0_N: U2.P22(IO_L16N_T2_34) U45.15
HDMI_RX_D0_P: U2.N22(IO_L16P_T2_34) U45.49
HDMI_RX_D1_N: U2.M22(IO_L15N_T2_DQS_34) U45.14
HDMI_RX_D1_P: U2.M21(IO_L15P_T2_DQS_34) U45.48
HDMI_RX_D2_N: U2.N20(IO_L14N_T2_SRCC_34) U45.12
HDMI_RX_D2_P: U2.N19(IO_L14P_T2_SRCC_34) U45.46
HDMI_RX_HPD: U2.R15(IO_25_34) U45.43
HDMI_RX_SCL: U2.K19(IO_L11P_T1_SRCC_34) U45.8
HDMI_RX_SDA: U2.K20(IO_L11N_T1_SRCC_34) U45.42
HDMI_TX_5V_CONN: C243.2 CN2.18(+5VPower) U78.13(5V_OUT)
HDMI_TX_CEC: U2.H20(IO_L19N_T3_VREF_35) U78.1(CEC_A)
HDMI_TX_CEC_CONN: CN2.13(CEC) U78.7(CEC_B)
HDMI_TX_CLK_N: CN2.12(TMDSClock-) R185.1 U2.C18(IO_L11N_T1_SRCC_35) U78.15(CLK-)
HDMI_TX_CLK_P: CN2.10(TMDSClock+) R186.1 U2.C17(IO_L11P_T1_SRCC_35) U78.16(CLK+)
HDMI_TX_CT_HPD: R176.1 U78.12(CT_HPD)
HDMI_TX_D0_N: CN2.9(TMDSData0-) R187.1 U2.C19(IO_L12N_T1_MRCC_35) U78.17(D0-)
HDMI_TX_D0_P: CN2.7(TMDSData0+) R188.1 U2.D18(IO_L12P_T1_MRCC_35) U78.18(D0+)
HDMI_TX_D1_N: CN2.6(TMDSData1-) R189.1 U2.A19(IO_L10N_T1_AD11N_35) U78.20(D1-)
HDMI_TX_D1_P: CN2.4(TMDSData1+) R190.1 U2.A18(IO_L10P_T1_AD11P_35) U78.21(D1+)
HDMI_TX_D2_N: CN2.3(TMDSData2-) R191.1 U2.C20(IO_L14N_T2_AD4N_SRCC_35) U78.22(D2-)
HDMI_TX_D2_P: CN2.1(TMDSData2+) R192.1 U2.D20(IO_L14P_T2_AD4P_SRCC_35) U78.23(D2+)
HDMI_TX_HPD: U2.H15(IO_0_34) U78.4(HPD_A-) U78.5(LS_OE)
HDMI_TX_HPD_CONN: CN2.19(HotPlugDetect) U78.10(HPD_B-)
HDMI_TX_SCL: U2.B16(IO_L8P_T1_AD10P_35) U78.2(SCL_A)
HDMI_TX_SCL_CONN: CN2.15(SCL) U78.8(SCL_B)
HDMI_TX_SDA: U2.B17(IO_L8N_T1_AD10N_35) U78.3(SDA_A)
HDMI_TX_SDA_CONN: CN2.16(SDA) U78.9(SDA_B)
INITB: R50.1 U2.T14(INIT_B_0)
IO_0_33: U2.U19(IO_0_33) U45.52
IO_25_13: U2.U7(IO_25_13) U44.60
IO_L1N_T0_33: U2.U21(IO_L1N_T0_33) U45.54
IO_L1P_T0_33: U2.T21(IO_L1P_T0_33) U45.51
IO_L2N_T0_33: U2.U22(IO_L2N_T0_33) U45.20
IO_L2P_T0_33: U2.T22(IO_L2P_T0_33) U45.17
IO_L3N_T0_DQS_33: U2.W22(IO_L3N_T0_DQS_33) U45.60
IO_L3P_T0_DQS_33: U2.V22(IO_L3P_T0_DQS_33) U45.23
IO_L4N_T0_33: U2.W21(IO_L4N_T0_33) U45.24
IO_L4P_T0_33: U2.W20(IO_L4P_T0_33) U45.58
IO_L5N_T0_33: U2.V20(IO_L5N_T0_33) U45.57
IO_L5P_T0_33: U2.U20(IO_L5P_T0_33) U45.18
IO_L6N_T0_VREF_33: U2.V19(IO_L6N_T0_VREF_33) U45.21
IO_L6P_T0_33: U2.V18(IO_L6P_T0_33) U45.55
IO_L7N_T1_13: U2.AB12(IO_L7N_T1_13) U44.36
IO_L7P_T1_13: U2.AA12(IO_L7P_T1_13) U44.2
IO_L8N_T1_13: U2.AB11(IO_L8N_T1_13) U44.37
IO_L8P_T1_13: U2.AA11(IO_L8P_T1_13) U44.3
IO_L8P_T1_33: U2.AA21(IO_L8P_T1_33) U45.29
IO_L9N_T1_33: U2.Y21(IO_L9N_T1_DQS_33) U45.26
IO_L9N_T1_DQS_13: U2.AB9(IO_L9N_T1_DQS_13) U44.6
IO_L9P_T1_33: U2.Y20(IO_L9P_T1_DQS_33) U45.61
IO_L9P_T1_DQS_13: U2.AB10(IO_L9P_T1_DQS_13) U44.5
IO_L10N_T1_13: U2.Y10(IO_L10N_T1_13) U44.40
IO_L10P_T1_13: U2.Y11(IO_L10P_T1_13) U44.39
IO_L11N_T1_SRCC_13: U2.AA8(IO_L11N_T1_SRCC_13) U44.43
IO_L11N_T1_SRCC_33: U2.AA19(IO_L11N_T1_SRCC_33) U45.64
IO_L11P_T1_SRCC_13: U2.AA9(IO_L11P_T1_SRCC_13) U44.42
IO_L11P_T1_SRCC_33: U2.Y19(IO_L11P_T1_SRCC_33) U45.27
IO_L12N_T1_MRCC_33: U2.AA18(IO_L12N_T1_MRCC_33) U45.30
IO_L12N_T1_SRCC_13: U2.Y8(IO_L12N_T1_MRCC_13) U44.9
IO_L12P_T1_MRCC_33: U2.Y18(IO_L12P_T1_MRCC_33) U45.63
IO_L12P_T1_SRCC_13: U2.Y9(IO_L12P_T1_MRCC_13) U44.8
IO_L13N_T2_MRCC_13: U2.Y5(IO_L13N_T2_MRCC_13) U44.49
IO_L13P_T2_MRCC_13: U2.Y6(IO_L13P_T2_MRCC_13) U44.48
IO_L14N_T2_SRCC_13: U2.AA6(IO_L14N_T2_SRCC_13) U44.12
IO_L14P_T2_SRCC_13: U2.AA7(IO_L14P_T2_SRCC_13) U44.11
IO_L15N_T2_DQS_13: U2.AB1(IO_L15N_T2_DQS_13) U44.18
IO_L15P_T2_DQS_13: U2.AB2(IO_L15P_T2_DQS_13) U44.52
IO_L16N_T2_13: U2.AB4(IO_L16N_T2_13) U44.15
IO_L16P_T2_13: U2.AB5(IO_L16P_T2_13) U44.14
IO_L17N_T2_13: U2.AB6(IO_L17N_T2_13) U44.46
IO_L17P_T2_13: U2.AB7(IO_L17P_T2_13) U44.45
IO_L18N_T2_13: U2.AA4(IO_L18N_T2_13) U44.51
IO_L18P_T2_13: U2.Y4(IO_L18P_T2_13) U44.17
IO_L19N_T3_VREF_13: U2.T6(IO_L19N_T3_VREF_13) U44.61
IO_L19P_T3_13: U2.R6(IO_L19P_T3_13) U44.63
IO_L20N_T3_13: U2.U4(IO_L20N_T3_13) U44.24
IO_L20P_T3_13: U2.T4(IO_L20P_T3_13) U44.27
IO_L21N_T3_DQS_13: U2.V4(IO_L21N_T3_DQS_13) U44.55
IO_L21P_T3_DQS_13: U2.V5(IO_L21P_T3_DQS_13) U44.23
IO_L22N_T3_13: U2.U5(IO_L22N_T3_13) U44.58
IO_L22P_T3_13: U2.U6(IO_L22P_T3_13) U44.26
IO_L23N_T3_13: U2.W7(IO_L23N_T3_13) U44.21
IO_L23P_T3_13: U2.V7(IO_L23P_T3_13) U44.57
IO_L24N_T3_13: U2.W5(IO_L24N_T3_13) U44.20
IO_L24P_T3_13: U2.W6(IO_L24P_T3_13) U44.54
MIO_VREF_0V9: C406.1 R78.2 R79.1 U2.F8(PS_MIO_VREF_501)
NPUDC: R46.1 U2.K16(IO_L3P_T0_DQS_PUDC_B_34)
OTG_DN: D11.2 U36.19(DM) USB1.2(D-)
OTG_DP: D10.2 U36.18(DP) USB1.3(D+)
OTG_ID: D9.2 U36.23(ID) USB1.4(ID)
PG_3V3: U61.2(A) ; also on sheet 2
PL_CLK_125MHZ: U2.B19(IO_L13P_T2_MRCC_35) ; also on sheet 6
PROGRAMB: R51.1 SW1.1 SW1.2 U2.T11(PROGRAM_B_0)
PS_CLK_33M333: R75.1 U2.F7(PS_CLK_500)
PS_LED: R81.2 R82.1 U2.G6(PS_MIO0_500)
PS_MIO11: H5.2 U2.B4(PS_MIO11_500)
PS_MIO12: H5.1 U2.C5(PS_MIO12_500)
PS_MIO13: H5.4 U2.A6(PS_MIO13_500)
PS_MIO48: H5.6 U2.D11(PS_MIO48_501)
PS_MIO49: H5.5 U2.C14(PS_MIO49_501)
PS_MIO50: H5.8 U2.D13(PS_MIO50_501)
PS_MIO51: H5.7 U2.C10(PS_MIO51_501)
PS_QSPI_CLK: R85.2 U2.A4(PS_MIO6_500)
QSPI_CLK: R85.1 R275.2 U63.6(CLK)
QSPI_CSB: R84.2 U2.A1(PS_MIO1_500) U63.1(CS#)
QSPI_DQ0_M3: R272.2 U2.A2(PS_MIO2_500) U63.5(DI(IO0))
QSPI_DQ1_M1: R89.2 U2.F6(PS_MIO3_500) U63.2(DO(IO1))
QSPI_DQ2_M2: R90.2 U2.E4(PS_MIO4_500) U63.3(WP#(IO2）)
QSPI_DQ3_M0: R88.2 U2.A3(PS_MIO5_500) U63.7(HOLD#/RESET#(IO3))
SD_CD: R227.1 R228.2 U2.B10(PS_MIO47_501)
SD_CLK: R174.2 U74.9(CLKA)
SD_CMD: U2.C8(PS_MIO41_501) U74.4(CMDA)
SD_D0: U2.D8(PS_MIO42_501) U74.6(DAT0A)
SD_D1: U2.B11(PS_MIO43_501) U74.7(DAT1A)
SD_D2: U2.E13(PS_MIO44_501) U74.1(DAT2A)
SD_D3: U2.B9(PS_MIO45_501) U74.3(DAT3A)
SDCARD_CLK: CARD2.5(CLK) U74.19(CLKB0)
SDCARD_CMD: CARD2.3(CMD) R229.1 U74.20(CMDB0)
SDCARD_D0: CARD2.7(DAT0) U74.18(DAT0B0)
SDCARD_D1: CARD2.8(DAT1) U74.16(DAT1B0)
SDCARD_D2: CARD2.1(DAT2) U74.23(DAT2B0)
SDCARD_D4: CARD2.2(CD/DAT3) U74.22(DAT3B0)
TCK: R58.2 U2.G11(TCK_0) ; also on sheet 5
TDI: R47.1 R56.2 U2.H13(TDI_0) ; also on sheet 5
TDO: R57.2 U2.G14(TDO_0) ; also on sheet 5
TMS: R48.1 R59.2 U2.G12(TMS_0) ; also on sheet 5
UART1_RX: U2.B6(PS_MIO14_500) ; also on sheet 5
UART1_TX_VCFG1: U2.E6(PS_MIO15_500) ; also on sheet 5
USB_CLK: U2.A9(PS_MIO36_501) U36.1(CLKOUT)
USB_DATA0: U2.C7(PS_MIO32_501) U36.3(DATA0)
USB_DATA1: U2.G13(PS_MIO33_501) U36.4(DATA1)
USB_DATA2: U2.B12(PS_MIO34_501) U36.5(DATA2)
USB_DATA3: U2.F14(PS_MIO35_501) U36.6(DATA3)
USB_DATA4: U2.A12(PS_MIO28_501) U36.7(DATA4)
USB_DATA5: U2.B14(PS_MIO37_501) U36.9(DATA5)
USB_DATA6: U2.F13(PS_MIO38_501) U36.10(DATA6)
USB_DATA7: U2.C13(PS_MIO39_501) U36.13(DATA7)
USB_DIR: U2.E8(PS_MIO29_501) U36.31(DIR)
USB_NXT: U2.F9(PS_MIO31_501) U36.2(NXT)
USB_RSTB: R232.2 U2.D12(PS_MIO46_501) U36.27(RESETB)
USB_STP: U2.A11(PS_MIO30_501) U36.29(STP)
~PS_POR: C194.1 R76.2 U2.B5(PS_POR_B_500) U61.4(Y) ; also on sheet 5
~PS_RST: C195.1 HDR1.14(PS_SRSTB) R77.2 SW2.1 SW2.2 U2.C9(PS_SRST_B_501)
$7N636: R75.2 X2.3(Output)
$7N1432: LED17.1(A) R80.1
$7N1937: R268.1 U2.E5(PS_MIO8_500)
$7N1942: R269.1 U2.D5(PS_MIO7_500)
$7N3074: LED17.2(C) Q7.3(D)
$7N3081: Q7.1(G) R81.1
$7N5387: R174.1 U2.E14(PS_MIO40_501)
$8N1381: LED14.1(A) R52.1
$8N1384: LED14.2(C) Q6.3(D)
$8N3125: D1.2 HDR1.10(TDI) R56.1
$8N3132: D2.2 HDR1.8(TDO) R57.1
$8N3139: D3.2 HDR1.6(TCK) R58.1
$8N3146: D4.2 HDR1.4(TMS) R59.1
$8N5120: Q6.1(G) R53.1
$13N955: R230.2 U74.24(SEL)
$14N1143: R231.1 U72.3(Output)
$14N1494: R231.2 U36.26(REFCLK)
$14N2668: R234.1 U36.22(VBUS)
$14N3764: R235.2 U36.17(CPEN) U73.4(ENABLE)
$14N3886: C227.1 D12.1(K) L12.1 R234.2
$14N4011: R236.2 U73.2(ILIMIT)
$14N4794: R233.2 U36.24(RBIAS)

Not connected (* = marked no-connect by the designer): CN2 14(Reserved(N.C.))*; HDR1 12(--)*; U2 A16(IO_L9P_T1_DQS_AD3P_35)* A17(IO_L9N_T1_DQS_AD3N_35)* A21(IO_L15P_T2_DQS_AD12P_35)* A22(IO_L15N_T2_DQS_AD12N_35)* AA13(IO_L23N_T3_33)* AA14(IO_L22N_T3_33)* AA16(IO_L18P_T2_33)* AA17(IO_L17P_T2_33)* AA22(IO_L7P_T1_33)* AB14(IO_L24P_T3_33)* AB15(IO_L24N_T3_33)* AB16(IO_L18N_T2_33)* AB17(IO_L17N_T2_33)* AB19(IO_L10P_T1_33)* AB20(IO_L10N_T1_33)* AB21(IO_L8N_T1_33)* AB22(IO_L7N_T1_33)* B15(IO_L7N_T1_AD2N_35)* B21(IO_L18P_T2_AD13P_35)* B22(IO_L18N_T2_AD13N_35)* C15(IO_L7P_T1_AD2P_35)* C22(IO_L16N_T2_35)* D15(IO_L3N_T0_DQS_AD1N_35)* D16(IO_L2P_T0_AD8P_35)* D17(IO_L2N_T0_AD8N_35)* D21(IO_L17N_T2_AD5N_35)* D22(IO_L16P_T2_35)* E15(IO_L3P_T0_DQS_AD1P_35)* E16(IO_L1N_T0_AD0N_35)* E18(IO_L5N_T0_AD9N_35)* E19(IO_L21P_T3_DQS_AD14P_35)* E20(IO_L21N_T3_DQS_AD14N_35)* E21(IO_L17P_T2_AD5P_35)* F16(IO_L1P_T0_AD0P_35)* F17(IO_L6N_T0_VREF_35)* F18(IO_L5P_T0_AD9P_35)* F19(IO_L20N_T3_AD6N_35)* F21(IO_L23P_T3_35)* F22(IO_L23N_T3_35)* G15(IO_L4P_T0_35)* G16(IO_L4N_T0_35)* G17(IO_L6P_T0_35)* G19(IO_L20P_T3_AD6P_35)* G20(IO_L22P_T3_AD7P_35)* G21(IO_L22N_T3_AD7N_35)* G22(IO_L24N_T3_AD15N_35)* H17(IO_0_35)* H18(IO_25_35)* H19(IO_L19P_T3_35)* H22(IO_L24P_T3_AD15P_35)* J15(IO_L1P_T0_34)* J16(IO_L2P_T0_34)* J17(IO_L2N_T0_34)* J18(IO_L7P_T1_34)* J20(IO_L9P_T1_DQS_34)* J21(IO_L8P_T1_34)* J22(IO_L8N_T1_34)* K15(IO_L1N_T0_34)* K18(IO_L7N_T1_34)* K21(IO_L9N_T1_DQS_34)* L16(IO_L3N_T0_DQS_34)* L17(IO_L4P_T0_34)* L18(IO_L12P_T1_MRCC_34)* L19(IO_L12N_T1_MRCC_34)* L21(IO_L10P_T1_34)* L22(IO_L10N_T1_34)* M15(IO_L6P_T0_34)* M16(IO_L6N_T0_VREF_34)* M17(IO_L4N_T0_34)* N15(IO_L19P_T3_34)* N17(IO_L5P_T0_34)* N18(IO_L5N_T0_34)* P15(IO_L19N_T3_VREF_34)* P16(IO_L24P_T3_34)* P17(IO_L20P_T3_34)* P18(IO_L20N_T3_34)* P20(IO_L18P_T2_34)* P21(IO_L18N_T2_34)* R7(IO_0_13)* R16(IO_L24N_T3_34)* R18(IO_L23P_T3_34)* R19(IO_L22P_T3_34)* R20(IO_L17P_T2_34)* R21(IO_L17N_T2_34)* T16(IO_L21P_T3_DQS_34)* T17(IO_L21N_T3_DQS_34)* T18(IO_L23N_T3_34)* T19(IO_L22N_T3_34)* U9(IO_L6N_T0_VREF_13)* U10(IO_L6P_T0_13)* U11(IO_L5N_T0_13)* U12(IO_L5P_T0_13)* U14(IO_25_33)* U15(IO_L15P_T2_DQS_33)* U16(IO_L15N_T2_DQS_33)* U17(IO_L16P_T2_33)* V8(IO_L2P_T0_13)* V9(IO_L1N_T0_13)* V10(IO_L1P_T0_13)* V12(IO_L4P_T0_13)* V13(IO_L20P_T3_33)* V14(IO_L19P_T3_33)* V15(IO_L19N_T3_VREF_33)* V17(IO_L16N_T2_33)* W8(IO_L2N_T0_13)* W10(IO_L3N_T0_DQS_13)* W11(IO_L3P_T0_DQS_13)* W12(IO_L4N_T0_13)* W13(IO_L20N_T3_33)* W15(IO_L21P_T3_DQS_33)* W16(IO_L14P_T2_SRCC_33)* W17(IO_L13P_T2_MRCC_33)* W18(IO_L13N_T2_MRCC_33)* Y13(IO_L23P_T3_33)* Y14(IO_L22P_T3_33)* Y15(IO_L21N_T3_DQS_33)* Y16(IO_L14N_T2_SRCC_33)*; U36 12(N/C)* 15(SPK_L)* 16(SPK_R)* 25(XO)*; U61 1(N.C.)*; U73 3(FAULTB)*; U74 8(DAT2B1)* 10(DAT3B1)* 12(CMDB1)* 13(CLKB1)* 14(DAT0B1)* 15(DAT1B1)*

## Notes on the sheets
sheet 7
- PS Clock
- Processing System
- ...
- See UG933, pg. 58
- 30-60 MHz OK
  33.333 MHz is tooling default
- Configure PS pinouts Vivado!
- Power on reset
- 3V3
- Reset
- MIO0 (_500) is 3V3
  MIO1 (_501) is 1V8 HSTL
  ETH
  USB
- Boot Mode
- 1V8
- PS LED
sheet 8
- QSPI Flash
- Programming
- To do:
  -
- QSPI (128-512Mbit)
- ...
- See 'Processor' sheet
- JTAG connection
- See UG470
- CG0402MLU-3.3G
- Done indicator
sheet 9
- HDMI
- ...
- Fly-by routing
- HDMI TX
sheet 10
- Banks 34,35 - HDMI
- ...
sheet 11
- Expansion Ports
- ...
- BAY > 36,2,37,3, ...
sheet 12
- SD Card Reader
- To do:
  -
- Placeholder...
sheet 13
- USB OTG
- USB 2.0 ULPI PHY
- CG0402MLU-3.3G
